# Altium project NUCLEOG431RB-Custom-IN-A2212.PrjPcb (part 2 of 3)

## Sheet Power_Section.SchDoc
size C
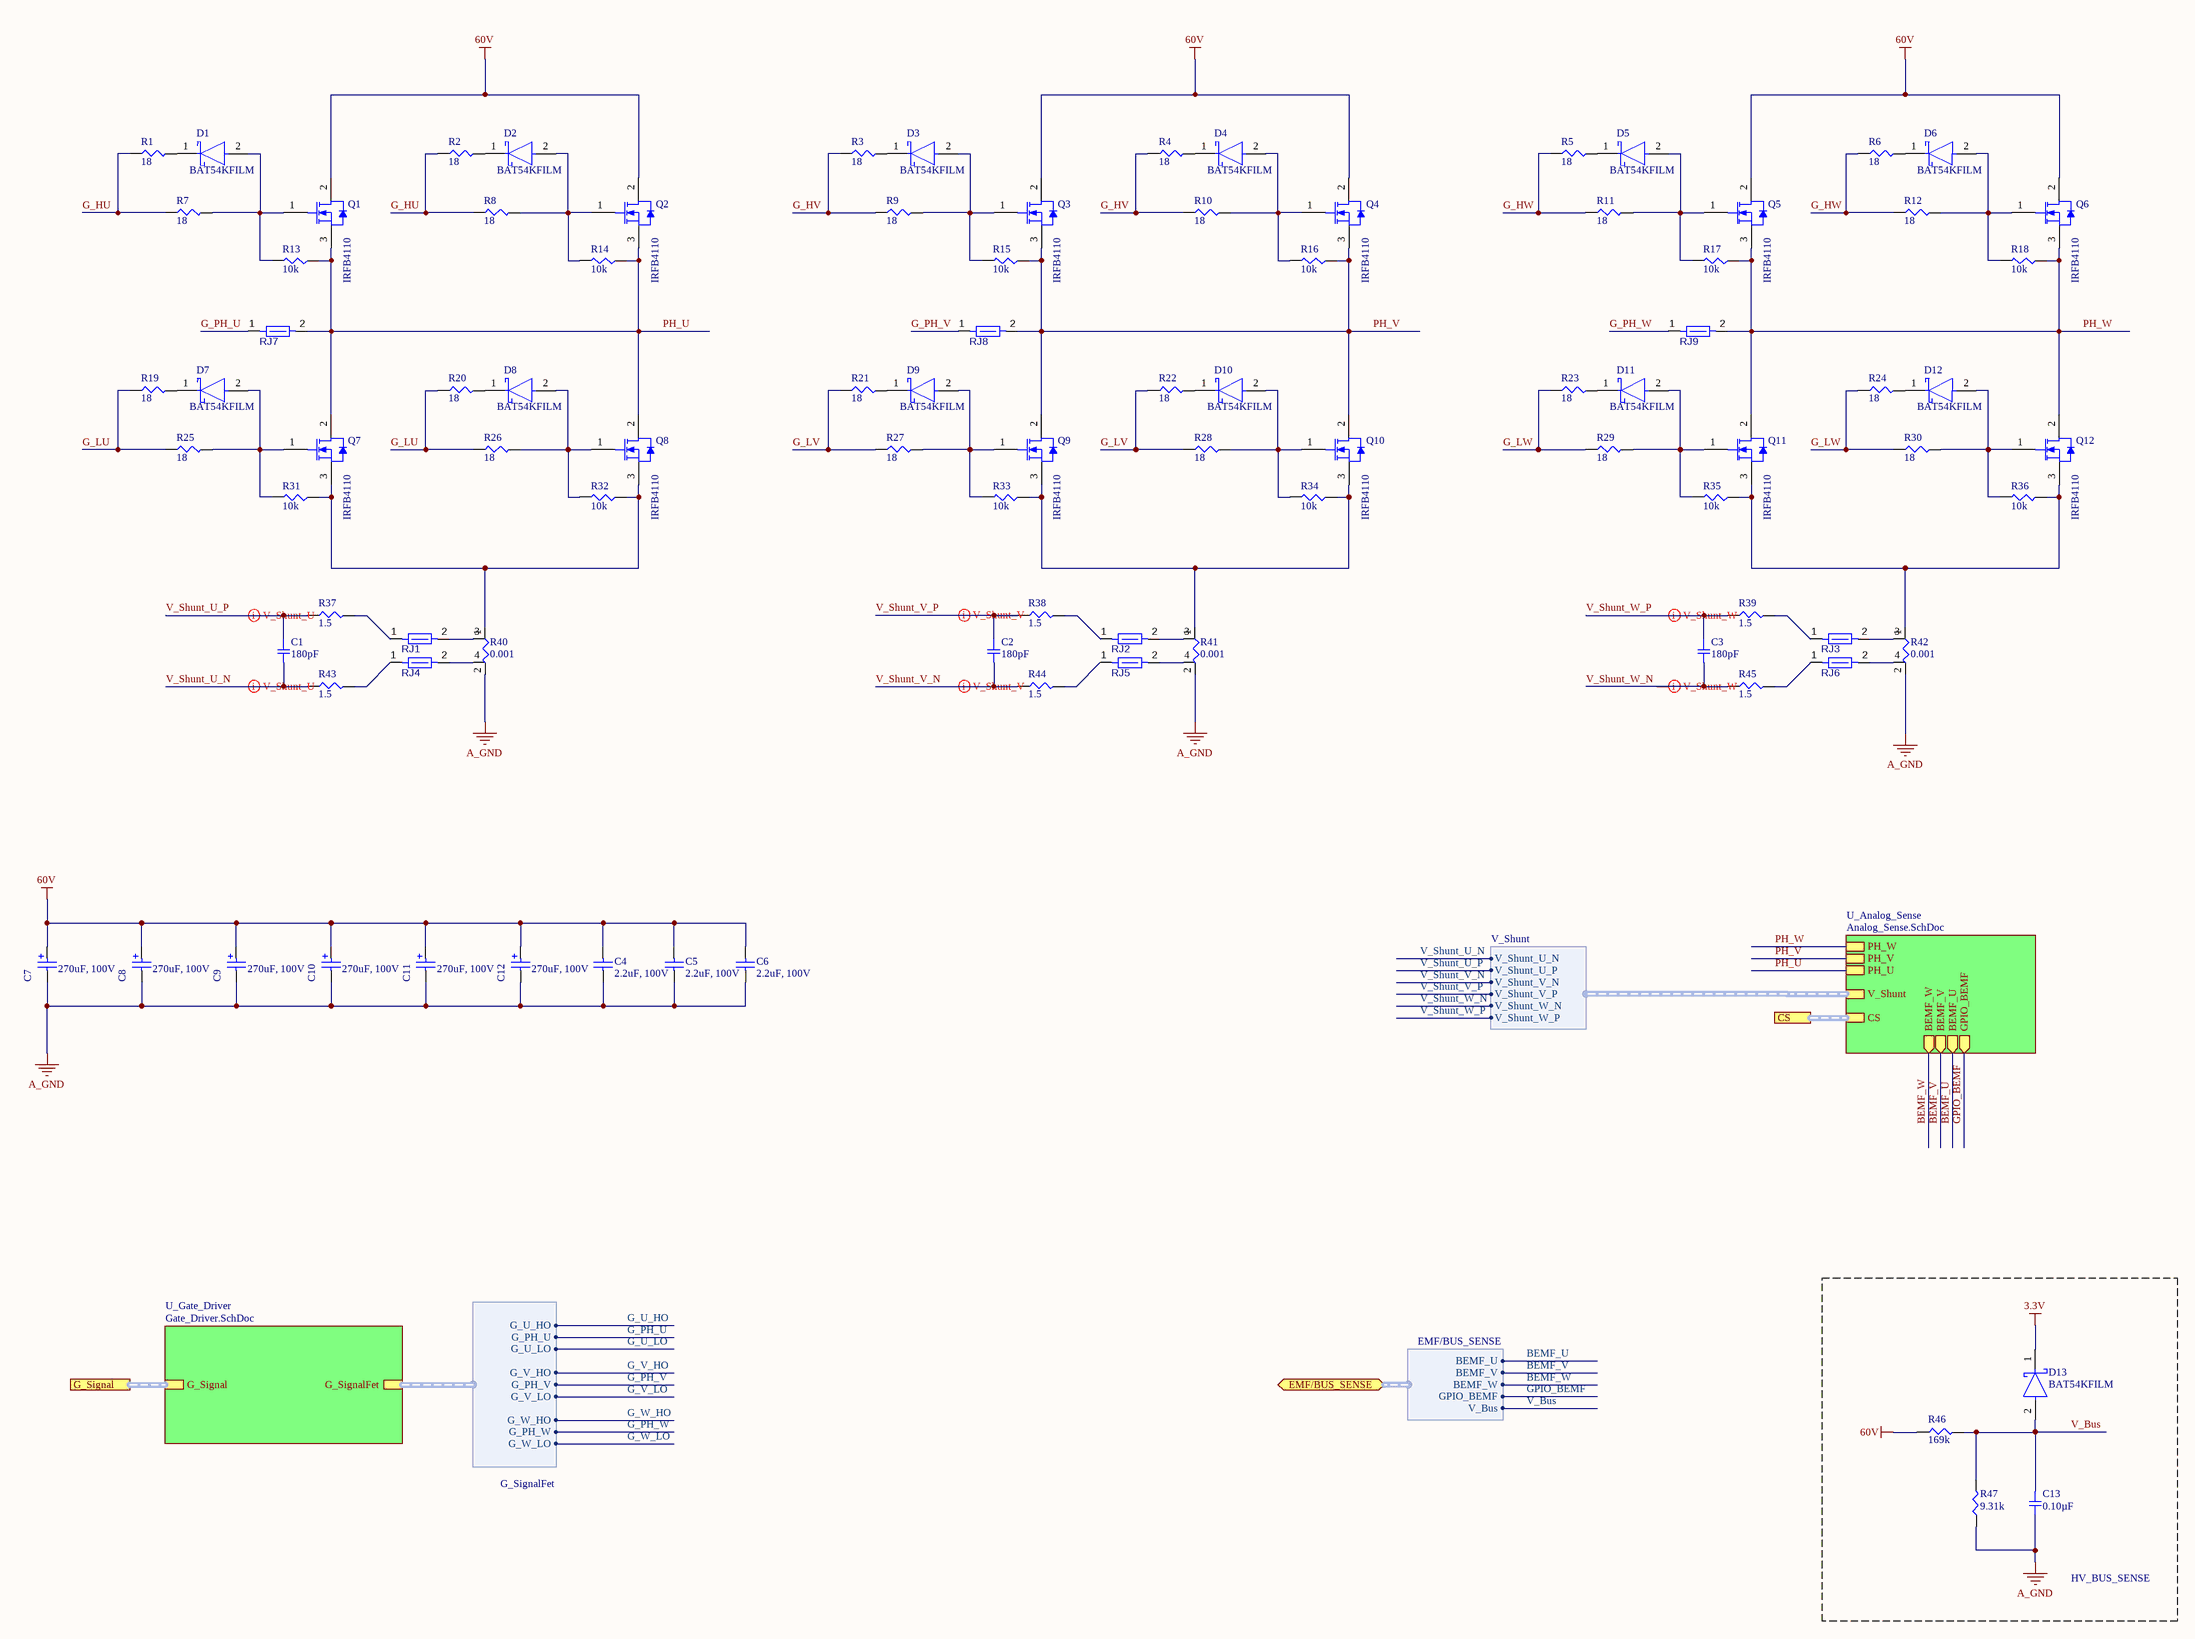
[diagram p3: Power_Section.SchDoc]

### Parts
C1  180pF  [SMD-0805C]
C2  180pF  [SMD-0805C]
C3  180pF  [SMD-0805C]
C4  2.2uF, 100V  [L18_W8.5_H15_P15]
C5  2.2uF, 100V  [L18_W8.5_H15_P15]
C6  2.2uF, 100V  [L18_W8.5_H15_P15]
C7  270uF, 100V  [WCAP-ATUL_16x25]
C8  270uF, 100V  [WCAP-ATUL_16x25]
C9  270uF, 100V  [WCAP-ATUL_16x25]
C10  270uF, 100V  [WCAP-ATUL_16x25]
C11  270uF, 100V  [WCAP-ATUL_16x25]
C12  270uF, 100V  [WCAP-ATUL_16x25]
C13  0.10µF  [SMD-0805C]
D1  BAT54KFILM  [FP-SOD-523-MFG]
D2  BAT54KFILM  [FP-SOD-523-MFG]
D3  BAT54KFILM  [FP-SOD-523-MFG]
D4  BAT54KFILM  [FP-SOD-523-MFG]
D5  BAT54KFILM  [FP-SOD-523-MFG]
D6  BAT54KFILM  [FP-SOD-523-MFG]
D7  BAT54KFILM  [FP-SOD-523-MFG]
D8  BAT54KFILM  [FP-SOD-523-MFG]
D9  BAT54KFILM  [FP-SOD-523-MFG]
D10  BAT54KFILM  [FP-SOD-523-MFG]
D11  BAT54KFILM  [FP-SOD-523-MFG]
D12  BAT54KFILM  [FP-SOD-523-MFG]
D13  BAT54KFILM  [FP-SOD-523-MFG]
Q1  IRFB4110  [TO-220-3_Horizontal_TabUp]
Q2  IRFB4110  [TO-220-3_Horizontal_TabUp]
Q3  IRFB4110  [TO-220-3_Horizontal_TabUp]
Q4  IRFB4110  [TO-220-3_Horizontal_TabUp]
Q5  IRFB4110  [TO-220-3_Horizontal_TabUp]
Q6  IRFB4110  [TO-220-3_Horizontal_TabUp]
Q7  IRFB4110  [TO-220-3_Horizontal_TabUp]
Q8  IRFB4110  [TO-220-3_Horizontal_TabUp]
Q9  IRFB4110  [TO-220-3_Horizontal_TabUp]
Q10  IRFB4110  [TO-220-3_Horizontal_TabUp]
Q11  IRFB4110  [TO-220-3_Horizontal_TabUp]
Q12  IRFB4110  [TO-220-3_Horizontal_TabUp]
R1  18  [SMD-0805-RES]
R2  18  [SMD-0805-RES]
R3  18  [SMD-0805-RES]
R4  18  [SMD-0805-RES]
R5  18  [SMD-0805-RES]
R6  18  [SMD-0805-RES]
R7  18  [SMD-0805-RES]
R8  18  [SMD-0805-RES]
R9  18  [SMD-0805-RES]
R10  18  [SMD-0805-RES]
R11  18  [SMD-0805-RES]
R12  18  [SMD-0805-RES]
R13  10k  [SMD-0805-RES]
R14  10k  [SMD-0805-RES]
R15  10k  [SMD-0805-RES]
R16  10k  [SMD-0805-RES]
R17  10k  [SMD-0805-RES]
R18  10k  [SMD-0805-RES]
R19  18  [SMD-0805-RES]
R20  18  [SMD-0805-RES]
R21  18  [SMD-0805-RES]
R22  18  [SMD-0805-RES]
R23  18  [SMD-0805-RES]
R24  18  [SMD-0805-RES]
R25  18  [SMD-0805-RES]
R26  18  [SMD-0805-RES]
R27  18  [SMD-0805-RES]
R28  18  [SMD-0805-RES]
R29  18  [SMD-0805-RES]
R30  18  [SMD-0805-RES]
R31  10k  [SMD-0805-RES]
R32  10k  [SMD-0805-RES]
R33  10k  [SMD-0805-RES]
R34  10k  [SMD-0805-RES]
R35  10k  [SMD-0805-RES]
R36  10k  [SMD-0805-RES]
R37  1.5  [SMD-0805-RES]
R38  1.5  [SMD-0805-RES]
R39  1.5  [SMD-0805-RES]
R40  0.001  [SMD-2512-RES]
R41  0.001  [SMD-2512-RES]
R42  0.001  [SMD-2512-RES]
R43  1.5  [SMD-0805-RES]
R44  1.5  [SMD-0805-RES]
R45  1.5  [SMD-0805-RES]
R46  169k  [SMD-0805-RES]
R47  9.31k  [SMD-0805-RES]
RJ1  Net Tie 12x8mil  [SHORT06-FP]  (value not drawn)  (net tie, no BOM)
RJ2  Net Tie 12x8mil  [SHORT06-FP]  (value not drawn)  (net tie, no BOM)
RJ3  Net Tie 12x8mil  [SHORT06-FP]  (value not drawn)  (net tie, no BOM)
RJ4  Net Tie 12x8mil  [SHORT06-FP]  (value not drawn)  (net tie, no BOM)
RJ5  Net Tie 12x8mil  [SHORT06-FP]  (value not drawn)  (net tie, no BOM)
RJ6  Net Tie 12x8mil  [SHORT06-FP]  (value not drawn)  (net tie, no BOM)
RJ7  Net Tie 12x8mil  [SHORT06-FP]  (value not drawn)  (net tie, no BOM)
RJ8  Net Tie 12x8mil  [SHORT06-FP]  (value not drawn)  (net tie, no BOM)
RJ9  Net Tie 12x8mil  [SHORT06-FP]  (value not drawn)  (net tie, no BOM)

### Blocks framed on the sheet
HV_BUS_SENSE: C13 D13 R46 R47

### Sub-sheets
U_Analog_Sense = Analog_Sense.SchDoc: PH_W, PH_U, PH_V, CS (harness CS), BEMF_W (out), BEMF_V (out), BEMF_U (out), GPIO_BEMF (out), V_Shunt (harness V_Shunt)
U_Gate_Driver = Gate_Driver.SchDoc: G_Signal (harness G_Signal), G_SignalFet (harness G_SignalFet)

### Ports
CS (harness CS), EMF/BUS_SENSE (bidir, harness EMF/BUS_SENSE), G_Signal (harness G_Signal)

### Harnesses
G_SignalFet: G_V_HO, G_PH_V, G_V_LO, G_PH_W, G_U_HO, G_PH_U, G_U_LO, G_W_HO, G_W_LO
EMF/BUS_SENSE: BEMF_U, BEMF_V, BEMF_W, GPIO_BEMF, V_Bus
V_Shunt: V_Shunt_U_N, V_Shunt_U_P, V_Shunt_V_N, V_Shunt_V_P, V_Shunt_W_N, V_Shunt_W_P

### Nets
3.3V: D13.1(C)
60V: C4.2 C5.2 C6.2 C7.2(P) C8.2(P) C9.2(P) C10.2(P) C11.2(P) C12.2(P) Q1.2(DRAIN) Q2.2(DRAIN) Q3.2(DRAIN) Q4.2(DRAIN) Q5.2(DRAIN) Q6.2(DRAIN) R46.1
A_GND: C4.1 C5.1 C6.1 C7.1(N) C8.1(N) C9.1(N) C10.1(N) C11.1(N) C12.1(N) C13.2 R40.2 R41.2 R42.2 R47.1
BEMF_U: sheet U_Analog_Sense/BEMF_U, port EMF/BUS_SENSE.BEMF_U
BEMF_V: sheet U_Analog_Sense/BEMF_V, port EMF/BUS_SENSE.BEMF_V
BEMF_W: sheet U_Analog_Sense/BEMF_W, port EMF/BUS_SENSE.BEMF_W
G_HU: R1.1 R2.1 R7.1 R8.1
G_HV: R3.1 R4.1 R9.1 R10.1
G_HW: R5.1 R6.1 R11.1 R12.1
G_LU: R19.1 R20.1 R25.1 R26.1
G_LV: R21.1 R22.1 R27.1 R28.1
G_LW: R23.1 R24.1 R29.1 R30.1
G_PH_U: RJ7.1 ; sheet U_Gate_Driver/G_SignalFet.G_PH_U
G_PH_V: RJ8.1 ; sheet U_Gate_Driver/G_SignalFet.G_PH_V
G_PH_W: RJ9.1 ; sheet U_Gate_Driver/G_SignalFet.G_PH_W
G_U_HO: sheet U_Gate_Driver/G_SignalFet.G_U_HO
G_U_LO: sheet U_Gate_Driver/G_SignalFet.G_U_LO
G_V_HO: sheet U_Gate_Driver/G_SignalFet.G_V_HO
G_V_LO: sheet U_Gate_Driver/G_SignalFet.G_V_LO
G_W_HO: sheet U_Gate_Driver/G_SignalFet.G_W_HO
G_W_LO: sheet U_Gate_Driver/G_SignalFet.G_W_LO
GPIO_BEMF: sheet U_Analog_Sense/GPIO_BEMF, port EMF/BUS_SENSE.GPIO_BEMF
PH_U: Q1.3(SOURCE) Q2.3(SOURCE) Q7.2(DRAIN) Q8.2(DRAIN) R13.1 R14.1 RJ7.2 ; sheet U_Analog_Sense/PH_U
PH_V: Q3.3(SOURCE) Q4.3(SOURCE) Q9.2(DRAIN) Q10.2(DRAIN) R15.1 R16.1 RJ8.2 ; sheet U_Analog_Sense/PH_V
PH_W: Q5.3(SOURCE) Q6.3(SOURCE) Q11.2(DRAIN) Q12.2(DRAIN) R17.1 R18.1 RJ9.2 ; sheet U_Analog_Sense/PH_W
V_Bus: C13.1 D13.2(A) R46.2 R47.2 ; port EMF/BUS_SENSE.V_Bus
V_Shunt_U_N: C1.2 R43.1 ; sheet U_Analog_Sense/V_Shunt.V_Shunt_U_N
V_Shunt_U_P: C1.1 R37.1 ; sheet U_Analog_Sense/V_Shunt.V_Shunt_U_P
V_Shunt_V_N: C2.2 R44.1 ; sheet U_Analog_Sense/V_Shunt.V_Shunt_V_N
V_Shunt_V_P: C2.1 R38.1 ; sheet U_Analog_Sense/V_Shunt.V_Shunt_V_P
V_Shunt_W_N: C3.2 R45.1 ; sheet U_Analog_Sense/V_Shunt.V_Shunt_W_N
V_Shunt_W_P: C3.1 R39.1 ; sheet U_Analog_Sense/V_Shunt.V_Shunt_W_P
NetD1_1: D1.1(C) R1.2
NetD1_2: D1.2(A) Q1.1(GATE) R7.2 R13.2
NetD2_1: D2.1(C) R2.2
NetD2_2: D2.2(A) Q2.1(GATE) R8.2 R14.2
NetD3_1: D3.1(C) R3.2
NetD3_2: D3.2(A) Q3.1(GATE) R9.2 R15.2
NetD4_1: D4.1(C) R4.2
NetD4_2: D4.2(A) Q4.1(GATE) R10.2 R16.2
NetD5_1: D5.1(C) R5.2
NetD5_2: D5.2(A) Q5.1(GATE) R11.2 R17.2
NetD6_1: D6.1(C) R6.2
NetD6_2: D6.2(A) Q6.1(GATE) R12.2 R18.2
NetD7_1: D7.1(C) R19.2
NetD7_2: D7.2(A) Q7.1(GATE) R25.2 R31.2
NetD8_1: D8.1(C) R20.2
NetD8_2: D8.2(A) Q8.1(GATE) R26.2 R32.2
NetD9_1: D9.1(C) R21.2
NetD9_2: D9.2(A) Q9.1(GATE) R27.2 R33.2
NetD10_1: D10.1(C) R22.2
NetD10_2: D10.2(A) Q10.1(GATE) R28.2 R34.2
NetD11_1: D11.1(C) R23.2
NetD11_2: D11.2(A) Q11.1(GATE) R29.2 R35.2
NetD12_1: D12.1(C) R24.2
NetD12_2: D12.2(A) Q12.1(GATE) R30.2 R36.2
NetQ7_3: Q7.3(SOURCE) Q8.3(SOURCE) R31.1 R32.1 R40.1
NetQ9_3: Q9.3(SOURCE) Q10.3(SOURCE) R33.1 R34.1 R41.1
NetQ11_3: Q11.3(SOURCE) Q12.3(SOURCE) R35.1 R36.1 R42.1
NetR37_2: R37.2 RJ1.1
NetR38_2: R38.2 RJ2.1
NetR39_2: R39.2 RJ3.1
NetR40_3: R40.3 RJ1.2
NetR40_4: R40.4 RJ4.2
NetR41_3: R41.3 RJ2.2
NetR41_4: R41.4 RJ5.2
NetR42_3: R42.3 RJ3.2
NetR42_4: R42.4 RJ6.2
NetR43_2: R43.2 RJ4.1
NetR44_2: R44.2 RJ5.1
NetR45_2: R45.2 RJ6.1

### Buses and harness runs
harness port CS = sheet U_Analog_Sense/CS
harness port G_Signal = sheet U_Gate_Driver/G_Signal

### Layout directives
differential pair: V_Shunt_U_N, V_Shunt_U_P, V_Shunt_V_N, V_Shunt_V_P, V_Shunt_W_N, V_Shunt_W_P

### Library data of the parts
C1-C3 = GQM2195C2A181GB12D: CAP CER 180PF 100V NP0 0805; Manufacturer: Murata Electronics North America; Factory Stock: 0; Unit Price (USD): 1.44; Minimum Quantity: 1; Tolerance: ±2%; Temperature Coefficient: C0G, NP0; Datasheets: http://www.murata.com/~/media/webrenewal/support/library/catalog/products/capacitor/mlcc/c02e.pdf; Image: //media.digikey.com/Renders/Murata%20Renders/0805(GxM9).jpg; Digi-Key Part Number: 490-7180-1-ND; Part Number: GQM2195C2A181GB12D; Quantity Available: 7523; @ qty: 0; Packaging: Cut Tape (CT); Series: GQM; Part Status: Active; Value: 180pF; Voltage: 100V; Operating Temperature: -55°C ~ 125°C; Features: High Q, Low Loss; Ratings: -; Applications: RF, Microwave, High Frequency; Mounting Type: Surface Mount, MLCC; Package / Case: 0805 (2012 Metric); Size / Dimension: 0.079" L x 0.049" W (2.01mm x 1.25mm); Height - Seated (Max): -; Thickness (Max): 0.037" (0.95mm); Lead Spacing: -; Lead Style: -
C4-C6 = 890263425004CS: WCAP-FTBE THT Film Capacitors, 2.2uF, 100VDC; Insulation Resistance: 3000Ohm x F; Dissipation Factor@100kHz: 5%; Dissipation Factor@1kHz: 1%; Dissipation Factor@10kHz: 1.6%; Pitch: 15mm; Rate of Voltage Rise: 9V/us; Technical Reference: MPSP015225K100DCPP45004; ComponentLink1Description: Manufacturer; ComponentLink1URL: http://www.we-online.de; ComponentLink2Description: Datasheet; ComponentLink2URL: https://katalog.we-online.com/pbs/datasheet/890263425004CS.pdf; Length: 18mm; Mounting Technology: THT; Packaging: Carton; Part Number: 890263425004CS; Operating Temperature: -40 to +85degC; Width: 8.5mm; Capacitance: 2.2uF; Height: 15mm; Rated Voltage: 100VDC; Publisher: Wurth Elektronik; Published Date: August 2019
C7-C12 = 860040880007: WCAP-ATUL THT Aluminum Electrolytic Capacitors, D16mm x L25mm, 270uF, +/-20%, 100VDC; Dissipation Factor: 9%; Endurance: 10000h; Leakage Current: 270uA; Ripple Current max.: 1480mA; Technical Reference: ATDK250271M100DSPAEK000; ComponentLink1Description: Manufacturer; ComponentLink1URL: http://www.we-online.de; ComponentLink2Description: Datasheet; ComponentLink2URL: https://katalog.we-online.com/pbs/datasheet/860040880007.pdf; Length: 25mm; Mounting Technology: THT; Operating Temperature: -40 to +105degC; Packaging: Ammo Pack; Published Date: August 2019; Capacitance: 270uF; Diameter: 16mm; Part Number: 860040880007; Publisher: Wurth Elektronik; Capacitance Tolerance: +/-20%; Rated Voltage: 100VDC
C13 = GCD21BR71H104KA01L: CAP CER 0.1UF 50V X7R 0805; Manufacturer: Murata Electronics North America; Factory Stock: 0; Unit Price (USD): 0.24; Minimum Quantity: 1; Tolerance: ±10%; Datasheets: http://www.murata.com/~/media/webrenewal/support/library/catalog/products/capacitor/mlcc/c03e.ashx; Image: //media.digikey.com/Renders/Murata%20Renders/0805%28GxM6%29.jpg; Digi-Key Part Number: 490-11955-1-ND; Part Number: GCD21BR71H104KA01L; Quantity Available: 157; @ qty: 0; Packaging: Cut Tape (CT); Series: GCD; Part Status: Active; Value: 0.10µF; Voltage: 50V; Temperature Coefficient: X7R; Operating Temperature: -55°C ~ 125°C; Features: -; Ratings: AEC-Q200; Applications: Automotive; Mounting Type: Surface Mount, MLCC; Package / Case: 0805 (2012 Metric); Size / Dimension: 0.079" L x 0.049" W (2.00mm x 1.25mm); Height - Seated (Max): -; Thickness (Max): 0.049" (1.25mm); Lead Spacing: -; Lead Style: -
D1-D13 = CMP-12187-000026-1: DIODE SCHOTTKY 40V 300MA SOD523; Manufacturer: STMicroelectronics; Capacitance: 7pF; Value: 7pF; Max Surge Forward Current: 1.25A; Peak Reverse Current: 1uA; Max Junction Temp: +150°C; Device Class L2: Diodes; Temperature Range Low: -40°C; Category: Diode; Manufacturer Part Number: BAT54KFILM; Digikey Description: DIODE SCHOTTKY 40V 300MA SOD523; Device Class L3: Schottky Diodes; Automotive: No; Height: 0.7mm; Octopart: https://octopart.com/bat54kfilm-stmicroelectronics-39618022; ComponentLink2Description: Datasheet; Temperature Range High: +150°C; Device Class L1: Discrete Semiconductors; Max Repetitive Reverse Voltage: 40V; RoHS: TRUE; Temperature: -40°C to +150°C; ComponentLink2URL: https://www.st.com/content/ccc/resource/technical/document/datasheet/07/50/54/f2/0d/ba/4a/79/CD00001322.pdf/files/CD00001322.pdf/jcr:content/translations/en.CD00001322.pdf; Lead Free: Yes; Forward Current: 300mA; Package: SOD-523; Mouser Description: Schottky Diodes & Rectifiers schottky diode
Q1-Q12 = CUSTOM-MOS: 100V 120A; PartNumber: IPW65R110CFDA; Manufacturer: Infineon; QG: 118Â nC; Green: TRUE; Ptot (max): 277.8Â W; VGS(th) (max): 4.5Â V; VDS (max): 650Â V; RthJA (max): 62Â K/W; IDpuls (max): 99.6Â A; RDS (on) (max): 110Â mOhm; VGS(th) (min): 3.5Â V; Rth: 0.45Â K/W; Packing: Tube; ID (max): 31.2Â A; Polarity: N; ComponentLink1Description: Manufacturer URL; ComponentLink3Description: Package Specification; DatasheetVersion: Rev. 2.0; PackageDescription: 3-Pin Plastic (Green) Transistor Single Outline Package, 15.94 x 20.95 mm Body, 5.44 mm Pitch; Halogen-free: available; Mounting Technology: Through Hole; PackageVersion: Rev. 03; ComponentLink2Description: Datasheet; ComponentLink3URL: http://www.infineon.com/cms/packages/Leaded_and_through-hole/P-PG-TO247/P-PG-TO247-3-44.html?__locale=en; ComponentLink2URL: http://www.infineon.com/dgdl/DS_IPX65R110CFDA_2_0.pdf?folderId=db3a3043163797a6011637d4bae7003b&fileId=db3a304336797ff90136ba7c820925a5; Technology: CoolMOS CFDA; PackageReference: PG-TO247-3-44; ComponentLink1URL: http://www.infineon.com/; RthJC (max): 0.45Â K/W
R1-R12 R19-R30 = ERJ-P06J180V: RES SMD 18 OHM 5% 1/2W 0805; Manufacturer: Panasonic Electronic Components; Factory Stock: 0; Unit Price (USD): 0.01839; @ qty: 1500; Minimum Quantity: 1; Power (Watts): 0.5W, 1/2W; Temperature Coefficient: ±300ppm/°C; Part Number: ERJ-P06J180V; Datasheets: https://industrial.panasonic.com/cdbs/www-data/pdf/RDA0000/AOA0000C243.pdf; Image: //media.digikey.com/Renders/Panasonic%20Renders/ERJ-0805%20Pkg.jpg; Digi-Key Part Number: P18ADCT-ND; Quantity Available: 114565; Packaging: Cut Tape (CT); Series: ERJ; Part Status: Active; Value: 18; Tolerance: ±5%; Composition: Thick Film; Features: Automotive AEC-Q200, Pulse Withstanding; Operating Temperature: -55°C ~ 155°C; Package / Case: 0805 (2012 Metric); Supplier Device Package: 0805; Size / Dimension: 0.079" L x 0.049" W (2.00mm x 1.25mm); Height - Seated (Max): 0.028" (0.70mm); Number of Terminations: 2; Failure Rate: -
R13-R18 R31-R36 = ERJ-6ENF1002V: RES SMD 10K OHM 1% 1/8W 0805; Manufacturer: Panasonic Electronic Components; Factory Stock: 0; Unit Price (USD): 0.00729; @ qty: 1500; Minimum Quantity: 1; Power (Watts): 0.125W, 1/8W; Temperature Coefficient: ±100ppm/°C; Part Number: ERJ-6ENF1002V; Datasheets: http://industrial.panasonic.com/www-cgi/jvcr13pz.cgi?E+PZ+3+AOA0002+ERJ6ENF1002V+7+WW; Image: //media.digikey.com/Renders/Panasonic%20Renders/ERJ-0805%20Pkg.jpg; Digi-Key Part Number: P10.0KCCT-ND; Quantity Available: 3985614; Packaging: Cut Tape (CT); Series: ERJ; Part Status: Active; Value: 10k; Tolerance: ±1%; Composition: Thick Film; Features: Automotive AEC-Q200; Operating Temperature: -55°C ~ 155°C; Package / Case: 0805 (2012 Metric); Supplier Device Package: 0805; Size / Dimension: 0.079" L x 0.049" W (2.00mm x 1.25mm); Height - Seated (Max): 0.028" (0.70mm); Number of Terminations: 2; Failure Rate: -
R37-R39 R43-R45 = ERJ-6BQF1R5V: RES SMD 1.5 OHM 1% 1/3W 0805; Manufacturer: Panasonic Electronic Components; Factory Stock: 0; Unit Price (USD): 0.07013; @ qty: 1500; Minimum Quantity: 1; Power (Watts): 0.333W, 1/3W; Temperature Coefficient: ±200ppm/°C; Part Number: ERJ-6BQF1R5V; Datasheets: https://industrial.panasonic.com/cdbs/www-data/pdf/RDA0000/AOA0000C239.pdf; Image: //media.digikey.com/Renders/Panasonic%20Renders/ERJ-0805%20Pkg.jpg; Digi-Key Part Number: P15992CT-ND; Quantity Available: 5905; Packaging: Cut Tape (CT); Series: ERJ; Part Status: Active; Value: 1.5; Tolerance: ±1%; Composition: Thick Film; Features: Automotive AEC-Q200, Current Sense; Operating Temperature: -55°C ~ 125°C; Package / Case: 0805 (2012 Metric); Supplier Device Package: 0805; Size / Dimension: 0.079" L x 0.049" W (2.00mm x 1.25mm); Height - Seated (Max): 0.028" (0.70mm); Number of Terminations: 2; Failure Rate: -
R40-R42 = ERJ-M1WTF1M0U: RES SMD 0.001 OHM 1% 1W 2512; Manufacturer: Panasonic Electronic Components; Factory Stock: 0; Unit Price (USD): 0.26384; @ qty: 1500; Minimum Quantity: 1; Temperature Coefficient: 250/ +450ppm/°C; Part Number: ERJ-M1WTF1M0U; Datasheets: http://industrial.panasonic.com/www-cgi/jvcr13pz.cgi?E+PZ+3+AOA0007+ERJM1WTF1M0U+7+WW; Image: //media.digikey.com/Renders/Panasonic%20Renders/ERJ-2512%20Pkg.jpg; Digi-Key Part Number: P1.0NDCT-ND; Quantity Available: 22959; Packaging: Cut Tape (CT); Series: ERJ; Part Status: Active; Value: 0.001; Tolerance: ±1%; Power (Watts): 1W; Composition: Metal Element; Features: Current Sense; Operating Temperature: -55°C ~ 170°C; Package / Case: 2512 (6432 Metric); Supplier Device Package: 2512; Size / Dimension: 0.252" L x 0.126" W (6.40mm x 3.20mm); Height - Seated (Max): 0.043" (1.10mm); Number of Terminations: 2; Failure Rate: -
R46 = ERJ-6ENF1693V: RES SMD 169K OHM 1% 1/8W 0805; Manufacturer: Panasonic Electronic Components; Factory Stock: 0; Unit Price (USD): 0.00729; @ qty: 1500; Minimum Quantity: 1; Power (Watts): 0.125W, 1/8W; Temperature Coefficient: ±100ppm/°C; Part Number: ERJ-6ENF1693V; Datasheets: http://industrial.panasonic.com/www-cgi/jvcr13pz.cgi?E+PZ+3+AOA0002+ERJ6ENF1693V+7+WW; Image: //media.digikey.com/Renders/Panasonic%20Renders/ERJ-0805%20Pkg.jpg; Digi-Key Part Number: P169KCCT-ND; Quantity Available: 4864; Packaging: Cut Tape (CT); Series: ERJ; Part Status: Active; Value: 169k; Tolerance: ±1%; Composition: Thick Film; Features: Automotive AEC-Q200; Operating Temperature: -55°C ~ 155°C; Package / Case: 0805 (2012 Metric); Supplier Device Package: 0805; Size / Dimension: 0.079" L x 0.049" W (2.00mm x 1.25mm); Height - Seated (Max): 0.028" (0.70mm); Number of Terminations: 2; Failure Rate: -
R47 = ERJ-6ENF9311V: RES SMD 9.31K OHM 1% 1/8W 0805; Manufacturer: Panasonic Electronic Components; Factory Stock: 0; Unit Price (USD): 0.00729; @ qty: 1500; Minimum Quantity: 1; Power (Watts): 0.125W, 1/8W; Temperature Coefficient: ±100ppm/°C; Part Number: ERJ-6ENF9311V; Datasheets: http://industrial.panasonic.com/www-cgi/jvcr13pz.cgi?E+PZ+3+AOA0002+ERJ6ENF9311V+7+WW; Image: //media.digikey.com/Renders/Panasonic%20Renders/ERJ-0805%20Pkg.jpg; Digi-Key Part Number: P9.31KCCT-ND; Quantity Available: 47337; Packaging: Cut Tape (CT); Series: ERJ; Part Status: Active; Value: 9.31k; Tolerance: ±1%; Composition: Thick Film; Features: Automotive AEC-Q200; Operating Temperature: -55°C ~ 155°C; Package / Case: 0805 (2012 Metric); Supplier Device Package: 0805; Size / Dimension: 0.079" L x 0.049" W (2.00mm x 1.25mm); Height - Seated (Max): 0.028" (0.70mm); Number of Terminations: 2; Failure Rate: -
RJ1-RJ9 = CMP-009-00121-1: Max Operating Temperature: 155°C; Min Operating Temperature: -55°C; Pins: 2

## Sheet Gate_Driver.SchDoc
size A3
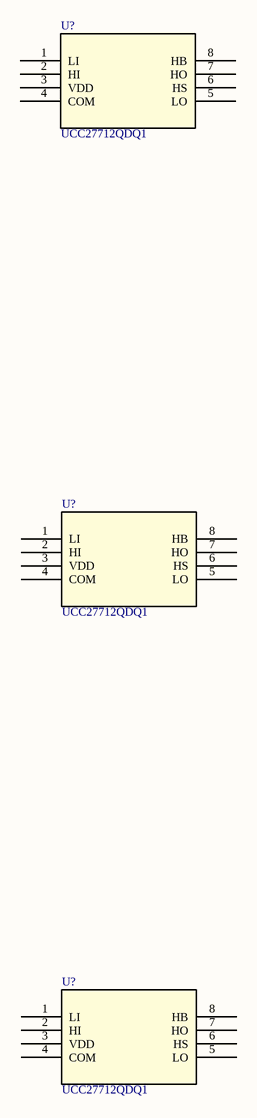
[diagram p4: Gate_Driver.SchDoc]

### Parts
(Parts that share a designator on the sheet are numbered #1, #2 ... from top to bottom, then left to right.)
U?#1  UCC27712QDQ1  [SOIC127P570X175_HS-9N]
U?#2  UCC27712QDQ1  [SOIC127P570X175_HS-9N]
U?#3  UCC27712QDQ1  [SOIC127P570X175_HS-9N]

### Nets

Not connected (* = marked no-connect by the designer): U?#1 1(LI) 2(HI) 3(VDD) 4(COM) 5(LO) 6(HS) 7(HO) 8(HB); U?#2 1(LI) 2(HI) 3(VDD) 4(COM) 5(LO) 6(HS) 7(HO) 8(HB); U?#3 1(LI) 2(HI) 3(VDD) 4(COM) 5(LO) 6(HS) 7(HO) 8(HB)

### Library data of the parts
U?#1-U?#3 = UCC27712QDQ1: No Description Available; Vendor: Texas Instruments; Built_By: EMA_Molly; SourceLibrary: TI_2019-05-11; Manufacturer_Part_Number: UCC27712QDQ1; Copyright: Copyright (C) 2018 Accelerated Designs. All rights reserved; RefDes: RefDes; Type: DEV

## Sheet Analog_Sense.SchDoc
size A3
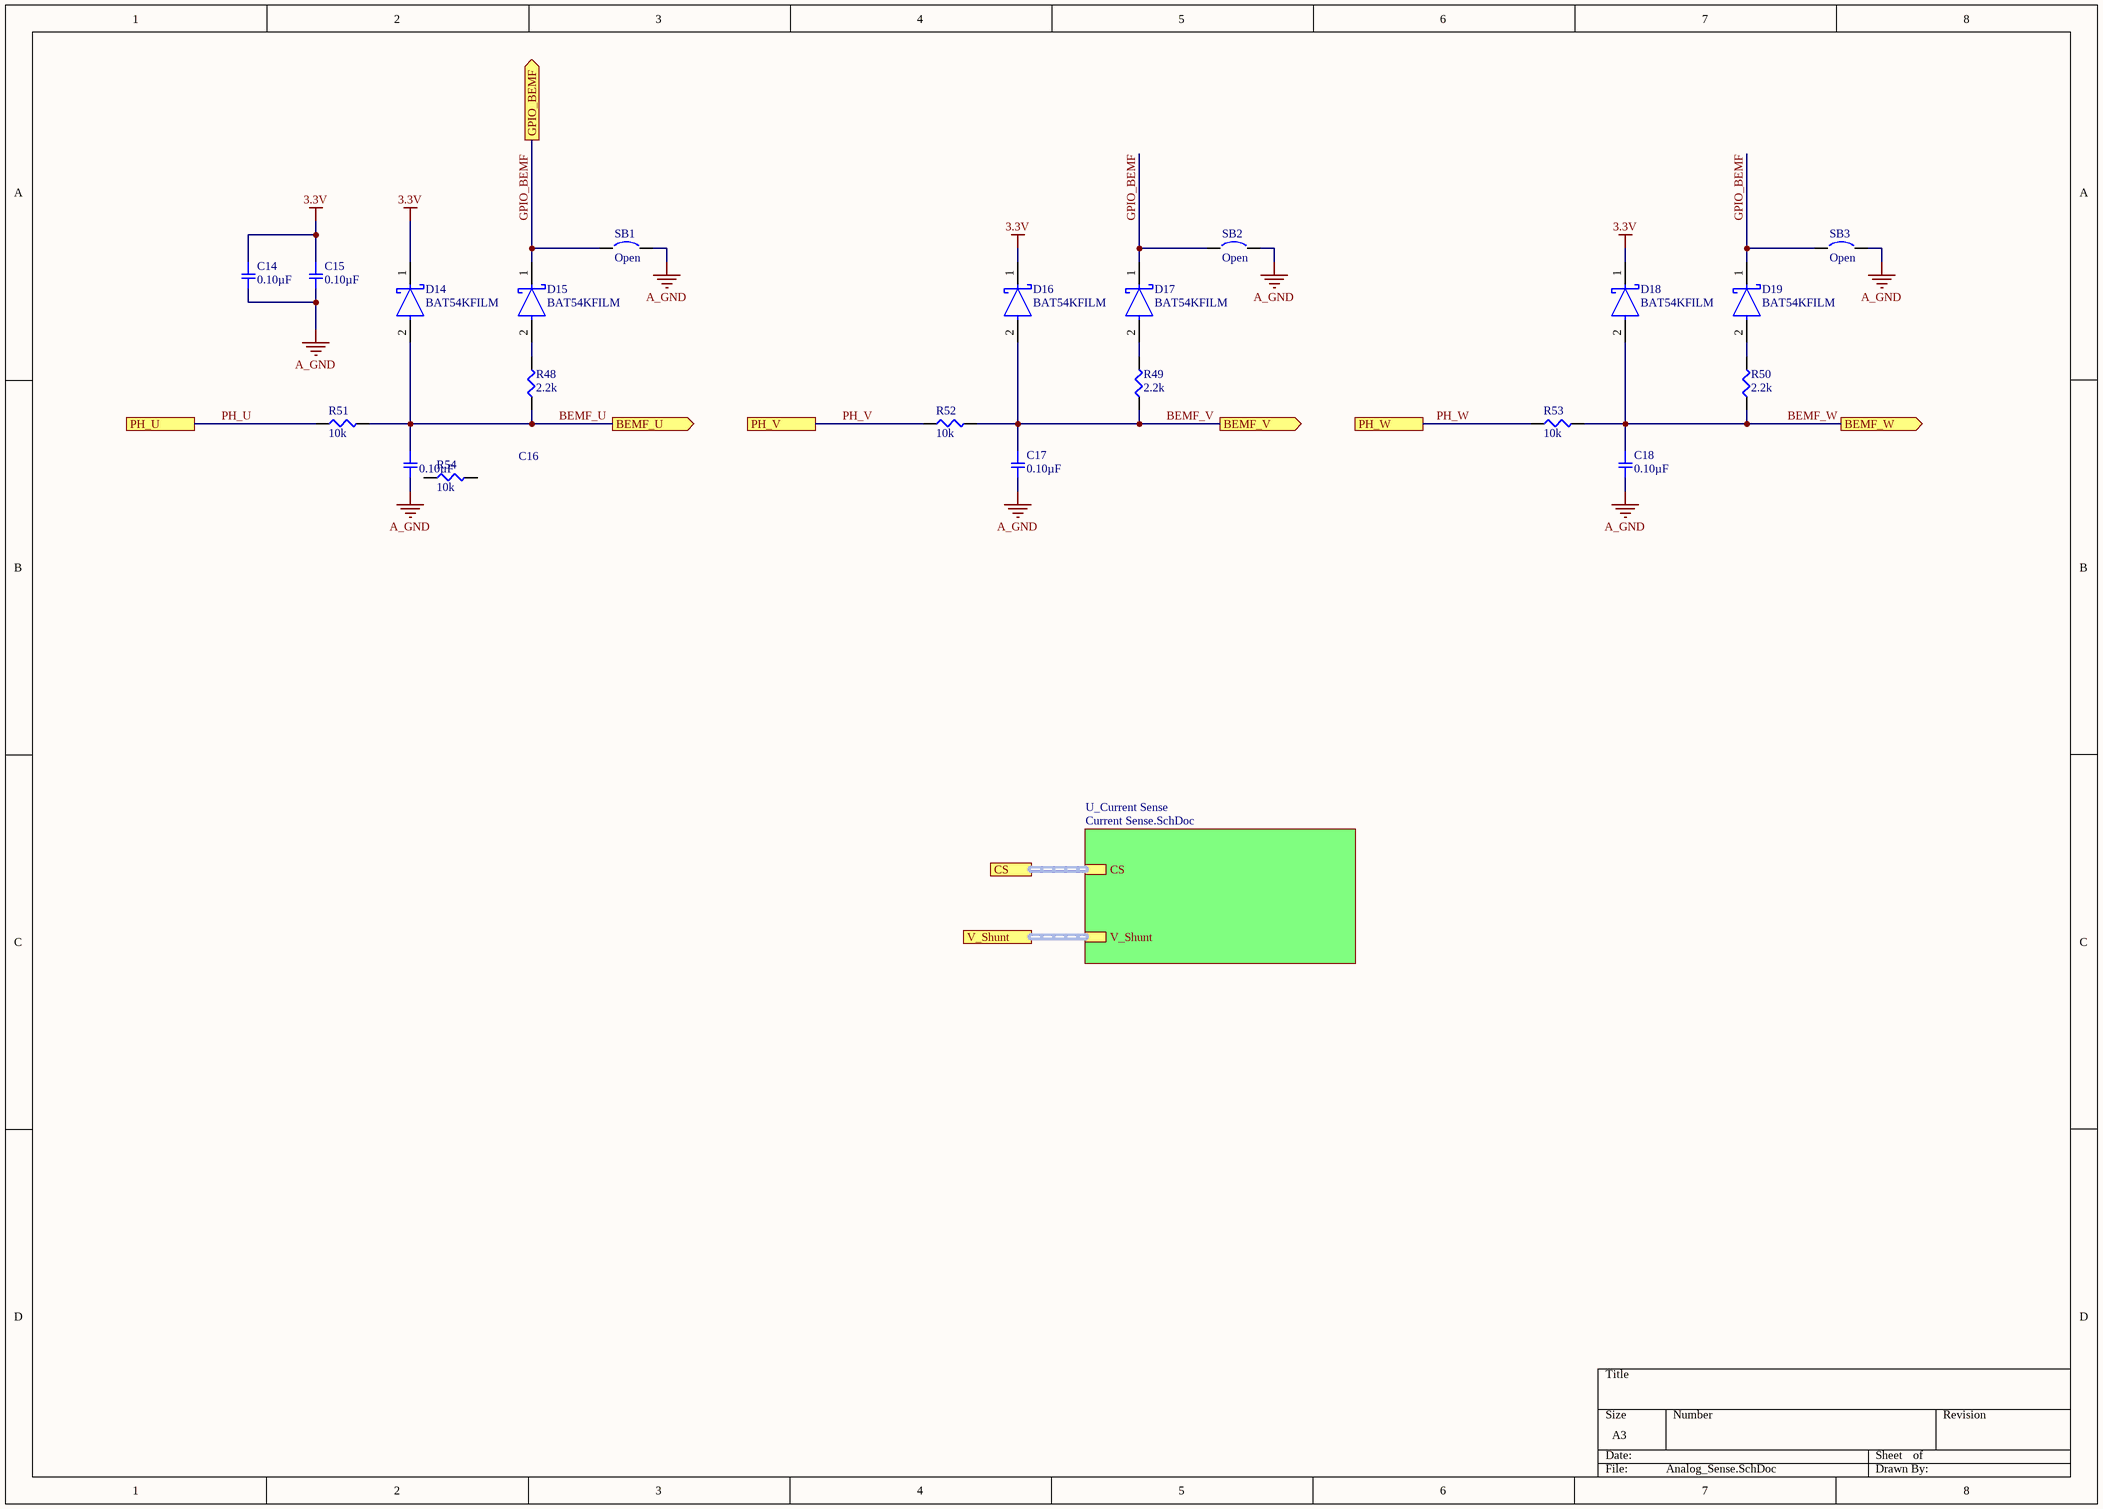
[diagram p5: Analog_Sense.SchDoc]

### Parts
C14  0.10µF  [SMD-0805C]
C15  0.10µF  [SMD-0805C]
C16  0.10µF  [SMD-0805C]
C17  0.10µF  [SMD-0805C]
C18  0.10µF  [SMD-0805C]
D14  BAT54KFILM  [FP-SOD-523-MFG]
D15  BAT54KFILM  [FP-SOD-523-MFG]
D16  BAT54KFILM  [FP-SOD-523-MFG]
D17  BAT54KFILM  [FP-SOD-523-MFG]
D18  BAT54KFILM  [FP-SOD-523-MFG]
D19  BAT54KFILM  [FP-SOD-523-MFG]
R48  2.2k  [SMD-1206-RES]
R49  2.2k  [SMD-1206-RES]
R50  2.2k  [SMD-1206-RES]
R51  10k  [SMD-0805-RES]
R52  10k  [SMD-0805-RES]
R53  10k  [SMD-0805-RES]
R54  10k  [SMD-0805-RES]
SB1  Open  [SB_0603]  (no BOM)
SB2  Open  [SB_0603]  (no BOM)
SB3  Open  [SB_0603]  (no BOM)

### Sub-sheets
U_Current Sense = Current Sense.SchDoc: CS (harness CS), V_Shunt (harness V_Shunt)

### Ports
BEMF_U (out), BEMF_V (out), BEMF_W (out), CS (harness CS), GPIO_BEMF (out), PH_U, PH_V, PH_W, V_Shunt (harness V_Shunt)

### Nets
3.3V: C14.1 C15.1 D14.1(C) D16.1(C) D18.1(C)
A_GND: C14.2 C15.2 C16.2 C17.2 C18.2 SB1.2 SB2.2 SB3.2
BEMF_U: C16.1 D14.2(A) R48.1 R51.2 ; port BEMF_U
BEMF_V: C17.1 D16.2(A) R49.1 R52.2 ; port BEMF_V
BEMF_W: C18.1 D18.2(A) R50.1 R53.2 ; port BEMF_W
GPIO_BEMF: D15.1(C) D17.1(C) D19.1(C) SB1.1 SB2.1 SB3.1 ; port GPIO_BEMF
PH_U: R51.1 ; port PH_U
PH_V: R52.1 ; port PH_V
PH_W: R53.1 ; port PH_W
NetD15_2: D15.2(A) R48.2
NetD17_2: D17.2(A) R49.2
NetD19_2: D19.2(A) R50.2

Not connected (* = marked no-connect by the designer): R54 1 2

### Buses and harness runs
harness port CS = sheet U_Current Sense/CS
harness port V_Shunt = sheet U_Current Sense/V_Shunt

### Library data of the parts
C14-C18 = GCD21BR71H104KA01L: as C13 on sheet Power_Section; Datasheets: http://www.murata.com/~/media/webrenewal/support/library/catalog/products/capacitor/mlcc/c03e.ashx; Image: //media.digikey.com/Renders/Murata%20Renders/0805%28GxM6%29.jpg; Digi-Key Part Number: 490-11955-1-ND; Part Number: GCD21BR71H104KA01L; Quantity Available: 157; @ qty: 0; Packaging: Cut Tape (CT); Series: GCD; Part Status: Active; Value: 0.10µF; Voltage: 50V; Temperature Coefficient: X7R; Operating Temperature: -55°C ~ 125°C; Features: -; Ratings: AEC-Q200; Applications: Automotive; Mounting Type: Surface Mount, MLCC; Package / Case: 0805 (2012 Metric); Size / Dimension: 0.079" L x 0.049" W (2.00mm x 1.25mm); Height - Seated (Max): -; Thickness (Max): 0.049" (1.25mm); Lead Spacing: -; Lead Style: -
D14-D19 = CMP-12187-000026-1: as D1 on sheet Power_Section; Device Class L2: Diodes; Temperature Range Low: -40°C; Category: Diode; Manufacturer Part Number: BAT54KFILM; Digikey Description: DIODE SCHOTTKY 40V 300MA SOD523; Device Class L3: Schottky Diodes; Automotive: No; Height: 0.7mm; Octopart: https://octopart.com/bat54kfilm-stmicroelectronics-39618022; ComponentLink2Description: Datasheet; Temperature Range High: +150°C; Device Class L1: Discrete Semiconductors; Max Repetitive Reverse Voltage: 40V; RoHS: TRUE; Temperature: -40°C to +150°C; ComponentLink2URL: https://www.st.com/content/ccc/resource/technical/document/datasheet/07/50/54/f2/0d/ba/4a/79/CD00001322.pdf/files/CD00001322.pdf/jcr:content/translations/en.CD00001322.pdf; Lead Free: Yes; Forward Current: 300mA; Package: SOD-523; Mouser Description: Schottky Diodes & Rectifiers schottky diode
R48-R50 = ERJ-8ENF2201V: RES SMD 2.2K OHM 1% 1/4W 1206; Manufacturer: Panasonic Electronic Components; Factory Stock: 0; Unit Price (USD): 0.00933; @ qty: 1500; Minimum Quantity: 1; Power (Watts): 0.25W, 1/4W; Temperature Coefficient: ±100ppm/°C; Part Number: ERJ-8ENF2201V; Datasheets: http://industrial.panasonic.com/www-cgi/jvcr13pz.cgi?E+PZ+3+AOA0002+ERJ8ENF2201V+7+WW; Image: //media.digikey.com/Renders/Panasonic%20Renders/ERJ-1206%20Pkg.jpg; Digi-Key Part Number: P2.20KFCT-ND; Quantity Available: 220817; Packaging: Cut Tape (CT); Series: ERJ; Part Status: Active; Value: 2.2k; Tolerance: ±1%; Composition: Thick Film; Features: Automotive AEC-Q200; Operating Temperature: -55°C ~ 155°C; Package / Case: 1206 (3216 Metric); Supplier Device Package: 1206; Size / Dimension: 0.126" L x 0.063" W (3.20mm x 1.60mm); Height - Seated (Max): 0.028" (0.70mm); Number of Terminations: 2; Failure Rate: -
R51-R54 = ERJ-6ENF1002V: as R13 on sheet Power_Section; Part Number: ERJ-6ENF1002V; Datasheets: http://industrial.panasonic.com/www-cgi/jvcr13pz.cgi?E+PZ+3+AOA0002+ERJ6ENF1002V+7+WW; Image: //media.digikey.com/Renders/Panasonic%20Renders/ERJ-0805%20Pkg.jpg; Digi-Key Part Number: P10.0KCCT-ND; Quantity Available: 3985614; Packaging: Cut Tape (CT); Series: ERJ; Part Status: Active; Value: 10k; Tolerance: ±1%; Composition: Thick Film; Features: Automotive AEC-Q200; Operating Temperature: -55°C ~ 155°C; Package / Case: 0805 (2012 Metric); Supplier Device Package: 0805; Size / Dimension: 0.079" L x 0.049" W (2.00mm x 1.25mm); Height - Seated (Max): 0.028" (0.70mm); Number of Terminations: 2; Failure Rate: -
SB1-SB3 = Solder Bridge: Circuit Breaker; Published: 24-Mar-1999; Revision: July-2002: Re-released for DXP Platform.; Publisher: Altium Limited

## Sheet Current Sense.SchDoc
size C
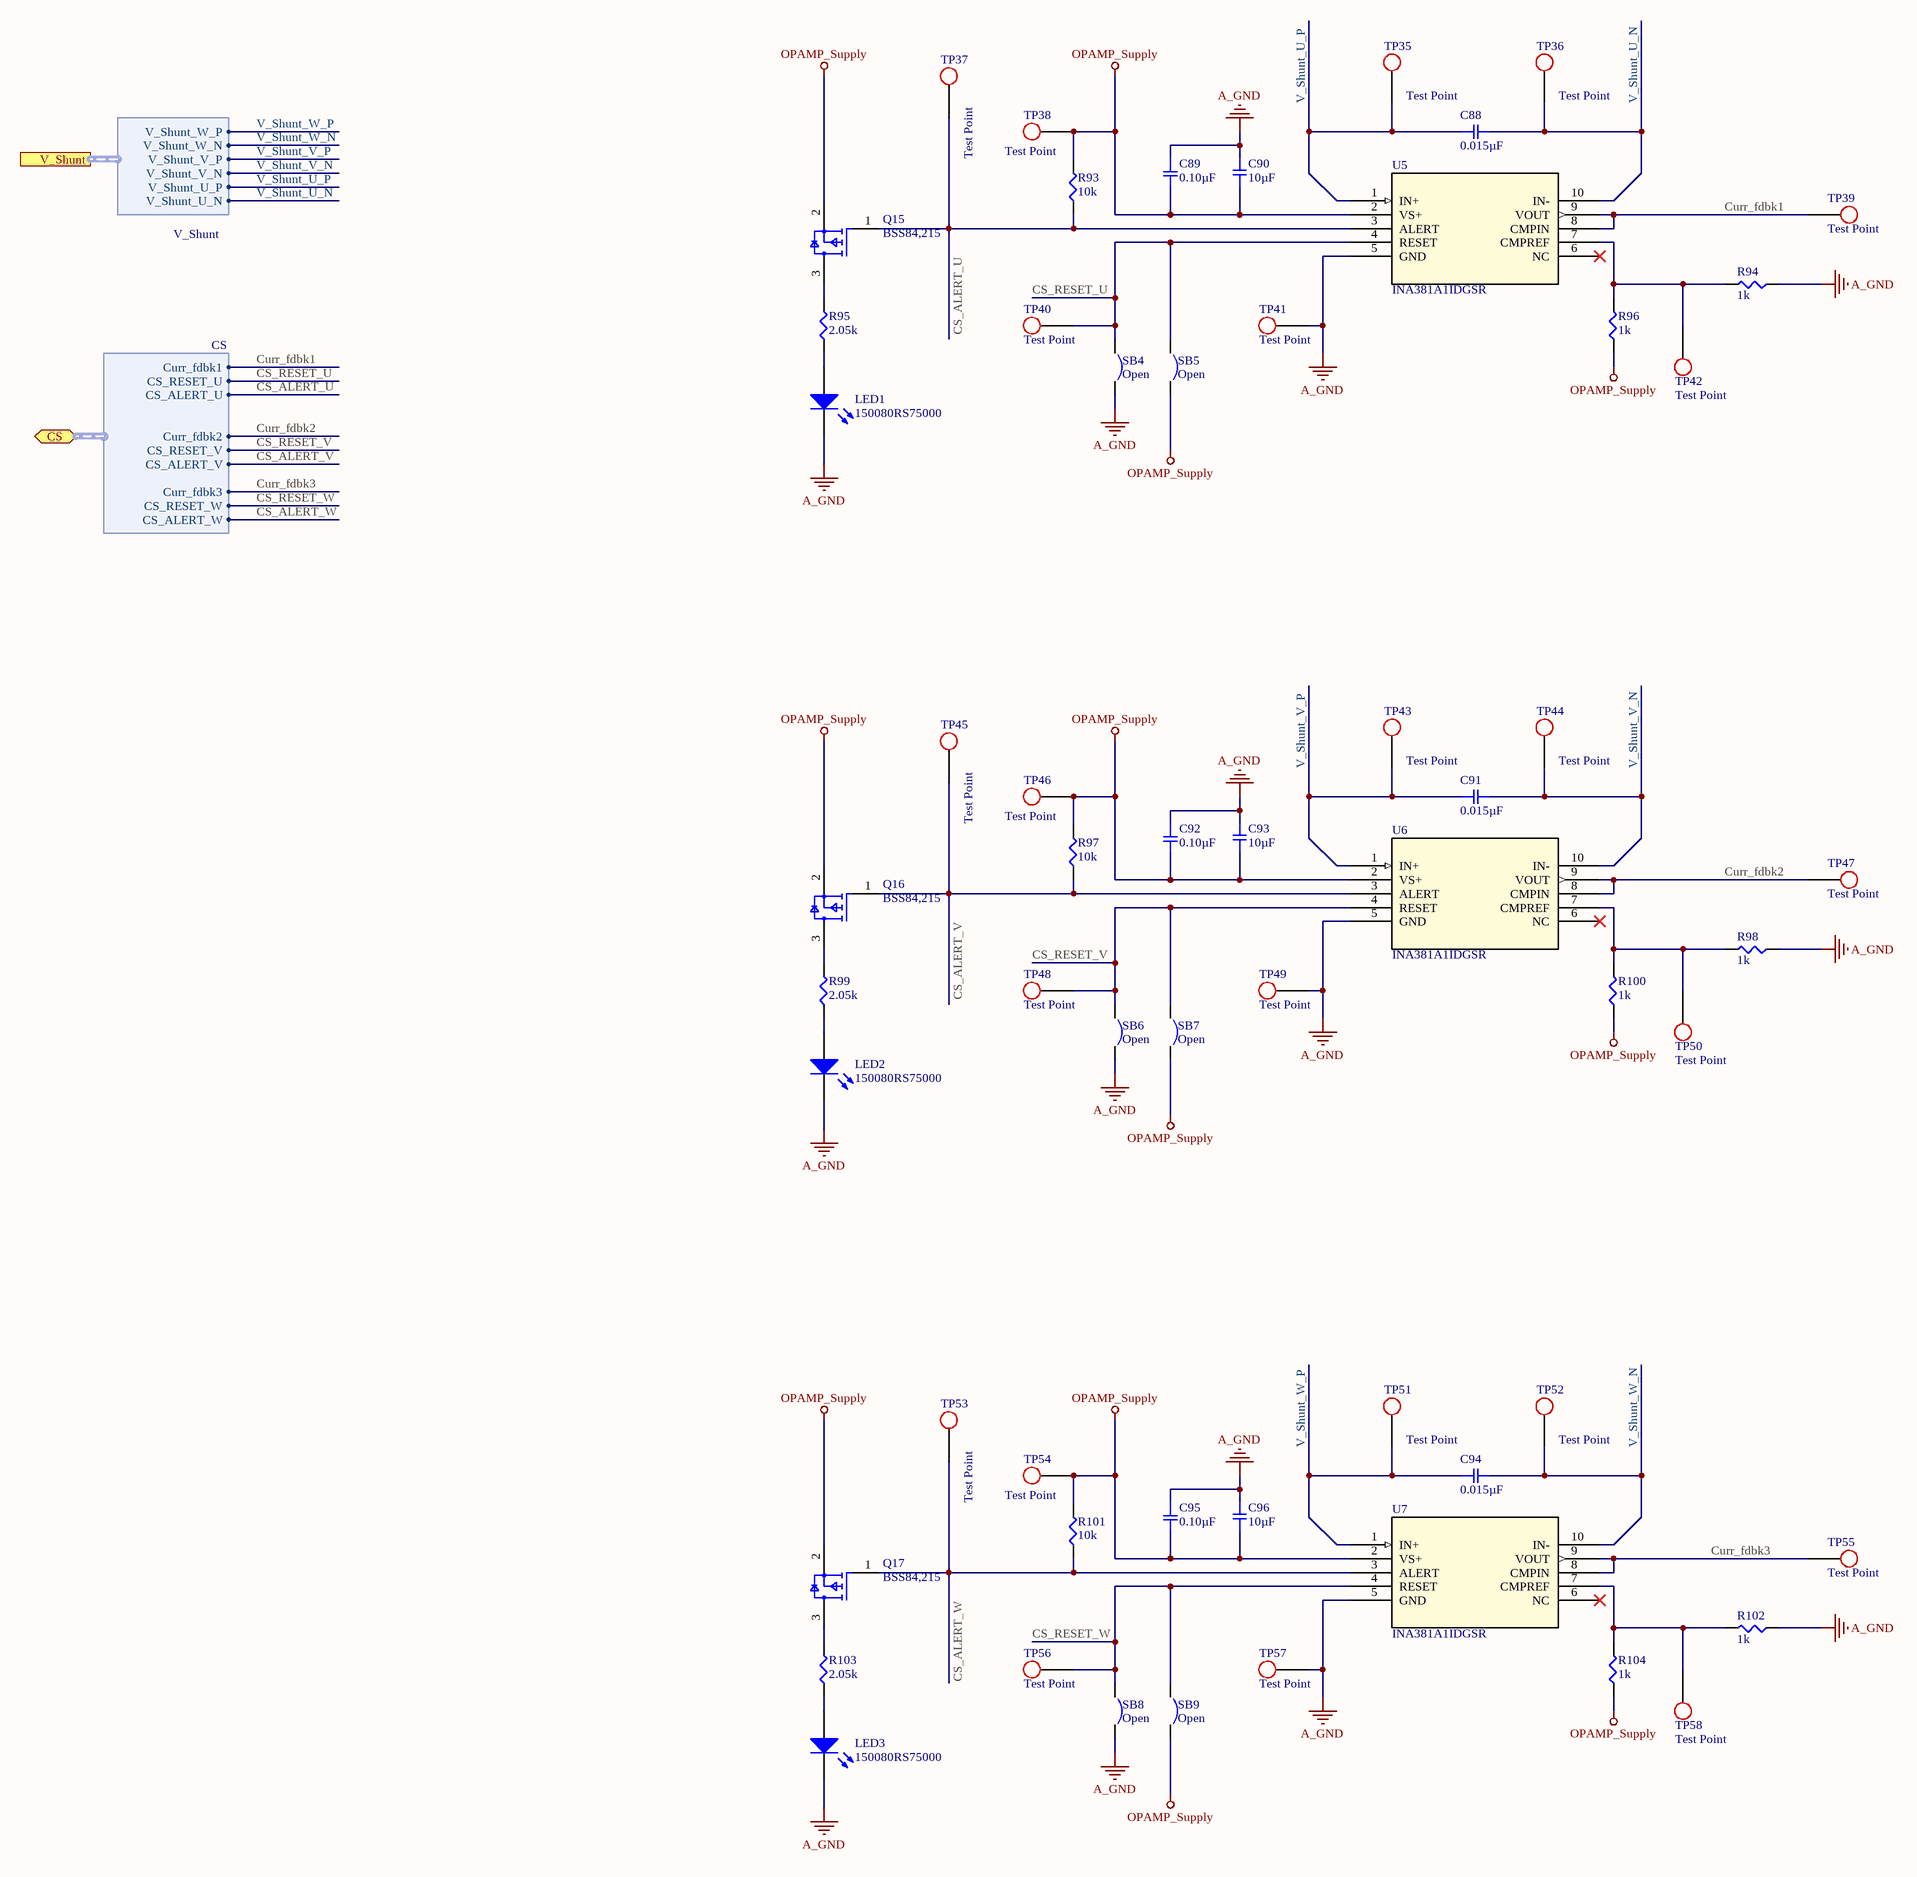
[diagram p6: Current Sense.SchDoc]

### Parts
C88  0.015µF  [SMD-0603C]
C89  0.10µF  [SMD-0805C]
C90  10µF  [SMD-1206C]
C91  0.015µF  [SMD-0603C]
C92  0.10µF  [SMD-0805C]
C93  10µF  [SMD-1206C]
C94  0.015µF  [SMD-0603C]
C95  0.10µF  [SMD-0805C]
C96  10µF  [SMD-1206C]
LED1  150080RS75000  [0805_A]
LED2  150080RS75000  [0805_A]
LED3  150080RS75000  [0805_A]
Q15  BSS84,215  [FP-SOT23-MFG]
Q16  BSS84,215  [FP-SOT23-MFG]
Q17  BSS84,215  [FP-SOT23-MFG]
R93  10k  [SMD-0603-RES]
R94  1k  [SMD-0603-RES]
R95  2.05k  [SMD-0603-RES]
R96  1k  [SMD-0603-RES]
R97  10k  [SMD-0603-RES]
R98  1k  [SMD-0603-RES]
R99  2.05k  [SMD-0603-RES]
R100  1k  [SMD-0603-RES]
R101  10k  [SMD-0603-RES]
R102  1k  [SMD-0603-RES]
R103  2.05k  [SMD-0603-RES]
R104  1k  [SMD-0603-RES]
SB4  Open  [SB_0603]  (no BOM)
SB5  Open  [SB_0603]  (no BOM)
SB6  Open  [SB_0603]  (no BOM)
SB7  Open  [SB_0603]  (no BOM)
SB8  Open  [SB_0603]  (no BOM)
SB9  Open  [SB_0603]  (no BOM)
TP35  Test Point  [Test_point_THT]  (no BOM)
TP36  Test Point  [Test_point_THT]  (no BOM)
TP37  Test Point  [Test_point_THT]  (no BOM)
TP38  Test Point  [Test_point_SMD]  (no BOM)
TP39  Test Point  [Test_point_THT]  (no BOM)
TP40  Test Point  [Test_point_SMD]  (no BOM)
TP41  Test Point  [Test_point_THT]  (no BOM)
TP42  Test Point  [Test_point_THT]  (no BOM)
TP43  Test Point  [Test_point_THT]  (no BOM)
TP44  Test Point  [Test_point_THT]  (no BOM)
TP45  Test Point  [Test_point_THT]  (no BOM)
TP46  Test Point  [Test_point_SMD]  (no BOM)
TP47  Test Point  [Test_point_THT]  (no BOM)
TP48  Test Point  [Test_point_SMD]  (no BOM)
TP49  Test Point  [Test_point_THT]  (no BOM)
TP50  Test Point  [Test_point_THT]  (no BOM)
TP51  Test Point  [Test_point_THT]  (no BOM)
TP52  Test Point  [Test_point_THT]  (no BOM)
TP53  Test Point  [Test_point_THT]  (no BOM)
TP54  Test Point  [Test_point_SMD]  (no BOM)
TP55  Test Point  [Test_point_THT]  (no BOM)
TP56  Test Point  [Test_point_SMD]  (no BOM)
TP57  Test Point  [Test_point_THT]  (no BOM)
TP58  Test Point  [Test_point_THT]  (no BOM)
U5  INA381A1IDGSR  [TSSOP50P490X110-10N]
U6  INA381A1IDGSR  [TSSOP50P490X110-10N]
U7  INA381A1IDGSR  [TSSOP50P490X110-10N]

### Ports
CS (bidir, harness CS), V_Shunt (harness V_Shunt)

### Harnesses
V_Shunt: V_Shunt_U_N, V_Shunt_U_P, V_Shunt_V_N, V_Shunt_V_P, V_Shunt_W_N, V_Shunt_W_P
CS: Curr_fdbk1, CS_RESET_U, CS_ALERT_U, Curr_fdbk2, CS_RESET_V, CS_ALERT_V, Curr_fdbk3, CS_RESET_W, CS_ALERT_W

### Nets
A_GND: C89.1 C90.2 C92.1 C93.2 C95.1 C96.2 LED1.1(K) LED2.1(K) LED3.1(K) R94.1 R98.1 R102.1 SB4.1 SB6.1 SB8.1 TP41.1 TP49.1 TP57.1 U5.5(GND) U6.5(GND) U7.5(GND)
OPAMP_Supply: C89.2 C90.1 C92.2 C93.1 C95.2 C96.1 Q15.2(S) Q16.2(S) Q17.2(S) R93.2 R96.1 R97.2 R100.1 R101.2 R104.1 SB5.1 SB7.1 SB9.1 TP38.1 TP46.1 TP54.1 U5.2(VS+) U6.2(VS+) U7.2(VS+)
CS_ALERT_U: Q15.1(G) R93.1 TP37.1 U5.3(ALERT) ; port CS.CS_ALERT_U
CS_ALERT_V: Q16.1(G) R97.1 TP45.1 U6.3(ALERT) ; port CS.CS_ALERT_V
CS_ALERT_W: Q17.1(G) R101.1 TP53.1 U7.3(ALERT) ; port CS.CS_ALERT_W
CS_RESET_U: SB4.2 SB5.2 TP40.1 U5.4(RESET) ; port CS.CS_RESET_U
CS_RESET_V: SB6.2 SB7.2 TP48.1 U6.4(RESET) ; port CS.CS_RESET_V
CS_RESET_W: SB8.2 SB9.2 TP56.1 U7.4(RESET) ; port CS.CS_RESET_W
Curr_fdbk1: TP39.1 U5.8(CMPIN) U5.9(VOUT) ; port CS.Curr_fdbk1
Curr_fdbk2: TP47.1 U6.8(CMPIN) U6.9(VOUT) ; port CS.Curr_fdbk2
Curr_fdbk3: TP55.1 U7.8(CMPIN) U7.9(VOUT) ; port CS.Curr_fdbk3
V_Shunt_U_N: C88.2 TP36.1 U5.10(IN-) ; port V_Shunt.V_Shunt_U_N
V_Shunt_U_P: C88.1 TP35.1 U5.1(IN+) ; port V_Shunt.V_Shunt_U_P
V_Shunt_V_N: C91.2 TP44.1 U6.10(IN-) ; port V_Shunt.V_Shunt_V_N
V_Shunt_V_P: C91.1 TP43.1 U6.1(IN+) ; port V_Shunt.V_Shunt_V_P
V_Shunt_W_N: C94.2 TP52.1 U7.10(IN-) ; port V_Shunt.V_Shunt_W_N
V_Shunt_W_P: C94.1 TP51.1 U7.1(IN+) ; port V_Shunt.V_Shunt_W_P
NetLED1_2: LED1.2(A) R95.1
NetLED2_2: LED2.2(A) R99.1
NetLED3_2: LED3.2(A) R103.1
NetQ15_3: Q15.3(D) R95.2
NetQ16_3: Q16.3(D) R99.2
NetQ17_3: Q17.3(D) R103.2
NetR94_2: R94.2 R96.2 TP42.1 U5.7(CMPREF)
NetR98_2: R98.2 R100.2 TP50.1 U6.7(CMPREF)
NetR102_2: R102.2 R104.2 TP58.1 U7.7(CMPREF)

Not connected (* = marked no-connect by the designer): U5 6(NC)*; U6 6(NC)*; U7 6(NC)*

### Library data of the parts
C88 C91 C94 = GCJ188R72A153KA01D: CAP CER 0.015UF 100V X7R 0603; Manufacturer: Murata Electronics North America; Factory Stock: 0; Unit Price (USD): 0.26; Minimum Quantity: 1; Tolerance: ±10%; Datasheets: http://www.murata.com/~/media/webrenewal/support/library/catalog/products/capacitor/mlcc/c03e.ashx; Image: //media.digikey.com/Renders/Murata%20Renders/0603%28LQG18%29.jpg; Digi-Key Part Number: 490-5770-1-ND; Part Number: GCJ188R72A153KA01D; Quantity Available: 450; @ qty: 0; Packaging: Cut Tape (CT); Series: GCJ; Part Status: Active; Value: 0.015µF; Voltage: 100V; Temperature Coefficient: X7R; Operating Temperature: -55°C ~ 125°C; Features: Soft Termination; Ratings: AEC-Q200; Applications: Automotive, Boardflex Sensitive; Mounting Type: Surface Mount, MLCC; Package / Case: 0603 (1608 Metric); Size / Dimension: 0.063" L x 0.031" W (1.60mm x 0.80mm); Height - Seated (Max): -; Thickness (Max): 0.031" (0.80mm); Lead Spacing: -; Lead Style: -
C89 C92 C95 = GCM21BR71H104KA37K: CAP CER 0.1UF 50V X7R 0805; Manufacturer: Murata Electronics North America; Factory Stock: 0; Unit Price (USD): 0.12; Minimum Quantity: 1; Tolerance: ±10%; Datasheets: http://www.murata.com/~/media/webrenewal/support/library/catalog/products/capacitor/mlcc/c03e.ashx; Image: //media.digikey.com/photos/Murata%20Photos/NCP,GCM%20SERIES%200805.jpg; Digi-Key Part Number: 490-8049-1-ND; Part Number: GCM21BR71H104KA37K; Quantity Available: 322; @ qty: 0; Packaging: Cut Tape (CT); Series: GCM; Part Status: Active; Value: 0.10µF; Voltage: 50V; Temperature Coefficient: X7R; Operating Temperature: -55°C ~ 125°C; Features: -; Ratings: AEC-Q200; Applications: Automotive; Mounting Type: Surface Mount, MLCC; Package / Case: 0805 (2012 Metric); Size / Dimension: 0.079" L x 0.049" W (2.00mm x 1.25mm); Height - Seated (Max): -; Thickness (Max): 0.055" (1.40mm); Lead Spacing: -; Lead Style: -
C90 C93 C96 = GRJ31CR71E106KE11L: CAP CER 10UF 25V X7R 1206; Manufacturer: Murata Electronics North America; Factory Stock: 0; Unit Price (USD): 0.69; Minimum Quantity: 1; Tolerance: ±10%; Datasheets: http://www.murata.com/~/media/webrenewal/support/library/catalog/products/capacitor/mlcc/c02e.pdf; Image: //media.digikey.com/Renders/Murata%20Renders/GR331BD72E473KW01L.jpg; Digi-Key Part Number: 490-10940-1-ND; Part Number: GRJ31CR71E106KE11L; Quantity Available: 1598; @ qty: 0; Packaging: Cut Tape (CT); Series: GRJ; Part Status: Active; Value: 10µF; Voltage: 25V; Temperature Coefficient: X7R; Operating Temperature: -55°C ~ 125°C; Features: Soft Termination; Ratings: -; Applications: Boardflex Sensitive; Mounting Type: Surface Mount, MLCC; Package / Case: 1206 (3216 Metric); Size / Dimension: 0.126" L x 0.063" W (3.20mm x 1.60mm); Height - Seated (Max): -; Thickness (Max): 0.075" (1.90mm); Lead Spacing: -; Lead Style: -
LED1-LED3 = 150080RS75000: SMD mono-color Chip LED, WL-SMCW, Red; PackageReference: 0805_A; Color: Red; PartNumber: 150080RS75000; ComponentLink1Description: Manufacturer URL; ComponentLink1URL: http://www.we-online.com; ComponentLink2Description: Datasheet; ComponentLink2URL: http://katalog.we-online.com/led/datasheet/150080RS75000.pdf
Q15-Q17 = CMP-14409-000006-1: MOSFET P-CH 50V 130MA SOT-23; Manufacturer: Nexperia USA Inc.; Drain To Source Breakdown Voltage: -50V; Description: P-Channel 50V 130mA (Ta) 250mW (Tc) Surface Mount TO-236AB; Max Junction Temp: +150°C; Threshold Vgs Min: -0.8V; Turn On Delay Time: 3ns; Power Dissipation: 250mW; Turn Off Delay Time: 7ns; Gate To Source Voltage: 20V; Number Of Channels: 1; Input Capacitace At Vds: 25pF @ -25V; Threshold Vgs Max: -2V; Continuous Drain Current: -130mA; Depletion Mode: False; Drain To Source Resistance: 6Ω; Rthja Max: 500K/W; Octopart: https://octopart.com/bss84%2C215-nexperia-78739375; Ipc Land Pattern Name: SOT95P230X100-3; Drain To Source Voltage: -50V; Lead Free: Yes; Temperature Range High: +150°C; Automotive: No; Device Class L2: Transistors; Manufacturer Part Number: BSS84,215; Package: SOT23; ComponentLink2URL: https://assets.nexperia.com/documents/data-sheet/BSS84.pdf; Category: Trans; RoHS: TRUE; Temperature Range Low: -65°C; ComponentLink2Description: Datasheet; Device Class L1: Discrete Semiconductors; Number Of P Channels: 1; Device Class L3: MOSFETs; Height: 1.1mm; Digikey Description: MOSFET P-CH 50V 130MA SOT-23; Temperature: -65°C to +150°C; Footprint Url: https://assets.nexperia.com/documents/outline-drawing/SOT23.pdf
R93 R97 R101 = ERJ-3EKF1002V: RES SMD 10K OHM 1% 1/10W 0603; Manufacturer: Panasonic Electronic Components; Factory Stock: 0; Unit Price (USD): 0.00379; @ qty: 1500; Minimum Quantity: 1; Power (Watts): 0.1W, 1/10W; Temperature Coefficient: ±100ppm/°C; Part Number: ERJ-3EKF1002V; Datasheets: http://industrial.panasonic.com/www-cgi/jvcr13pz.cgi?E+PZ+3+AOA0002+ERJ3EKF1002V+7+WW; Image: //media.digikey.com/Photos/Panasonic%20Photos/MFG_ERJ-P6W%20Series.jpg; Digi-Key Part Number: P10.0KHCT-ND; Quantity Available: 6703141; Packaging: Cut Tape (CT); Series: ERJ; Part Status: Active; Value: 10k; Tolerance: ±1%; Composition: Thick Film; Features: Automotive AEC-Q200; Operating Temperature: -55°C ~ 155°C; Package / Case: 0603 (1608 Metric); Supplier Device Package: 0603; Size / Dimension: 0.063" L x 0.031" W (1.60mm x 0.80mm); Height - Seated (Max): 0.022" (0.55mm); Number of Terminations: 2; Failure Rate: -
R94 R96 R98 R100 R102 R104 = ERJ-3EKF1001V: RES SMD 1K OHM 1% 1/10W 0603; Manufacturer: Panasonic Electronic Components; Factory Stock: 0; Unit Price (USD): 0.00379; @ qty: 1500; Minimum Quantity: 1; Power (Watts): 0.1W, 1/10W; Temperature Coefficient: ±100ppm/°C; Part Number: ERJ-3EKF1001V; Datasheets: http://industrial.panasonic.com/www-cgi/jvcr13pz.cgi?E+PZ+3+AOA0002+ERJ3EKF1001V+7+WW; Image: //media.digikey.com/Photos/Panasonic%20Photos/MFG_ERJ-P6W%20Series.jpg; Digi-Key Part Number: P1.00KHCT-ND; Quantity Available: 5218845; Packaging: Cut Tape (CT); Series: ERJ; Part Status: Active; Value: 1k; Tolerance: ±1%; Composition: Thick Film; Features: Automotive AEC-Q200; Operating Temperature: -55°C ~ 155°C; Package / Case: 0603 (1608 Metric); Supplier Device Package: 0603; Size / Dimension: 0.063" L x 0.031" W (1.60mm x 0.80mm); Height - Seated (Max): 0.022" (0.55mm); Number of Terminations: 2; Failure Rate: -
R95 R99 R103 = ERJ-3EKF2051V: RES SMD 2.05K OHM 1% 1/10W 0603; Manufacturer: Panasonic Electronic Components; Factory Stock: 0; Unit Price (USD): 0.00379; @ qty: 1500; Minimum Quantity: 1; Power (Watts): 0.1W, 1/10W; Temperature Coefficient: ±100ppm/°C; Part Number: ERJ-3EKF2051V; Datasheets: http://industrial.panasonic.com/www-cgi/jvcr13pz.cgi?E+PZ+3+AOA0002+ERJ3EKF2051V+7+WW; Image: //media.digikey.com/Photos/Panasonic%20Photos/MFG_ERJ-P6W%20Series.jpg; Digi-Key Part Number: P2.05KHCT-ND; Quantity Available: 48175; Packaging: Cut Tape (CT); Series: ERJ; Part Status: Active; Value: 2.05k; Tolerance: ±1%; Composition: Thick Film; Features: Automotive AEC-Q200; Operating Temperature: -55°C ~ 155°C; Package / Case: 0603 (1608 Metric); Supplier Device Package: 0603; Size / Dimension: 0.063" L x 0.031" W (1.60mm x 0.80mm); Height - Seated (Max): 0.022" (0.55mm); Number of Terminations: 2; Failure Rate: -
SB4-SB9 = Solder Bridge: Circuit Breaker; Published: 24-Mar-1999; Revision: July-2002: Re-released for DXP Platform.; Publisher: Altium Limited
U5-U7 = INA381A1IDGSR: No Description Available; SourceLibrary: Texas_Instruments_2020-07-20; Built_By: EMA_Matt; Vendor: Texas Instruments; Datasheet: https://www.ti.com/lit/ds/symlink/ina381.pdf?ts=1595282869145&ref_url=https%253A%252F%252Fwww.ti.com%252Fstore%252Fti%252Fen%252Fp%252Fproduct%252F%253Fp%253DINA381A1IDGSR; Copyright: Copyright (C) 2018 Accelerated Designs. All rights reserved; Manufacturer_Part_Number: INA381A1IDGSR; RefDes: RefDes; Type: DEV

## Sheet Connector.SchDoc
size A3
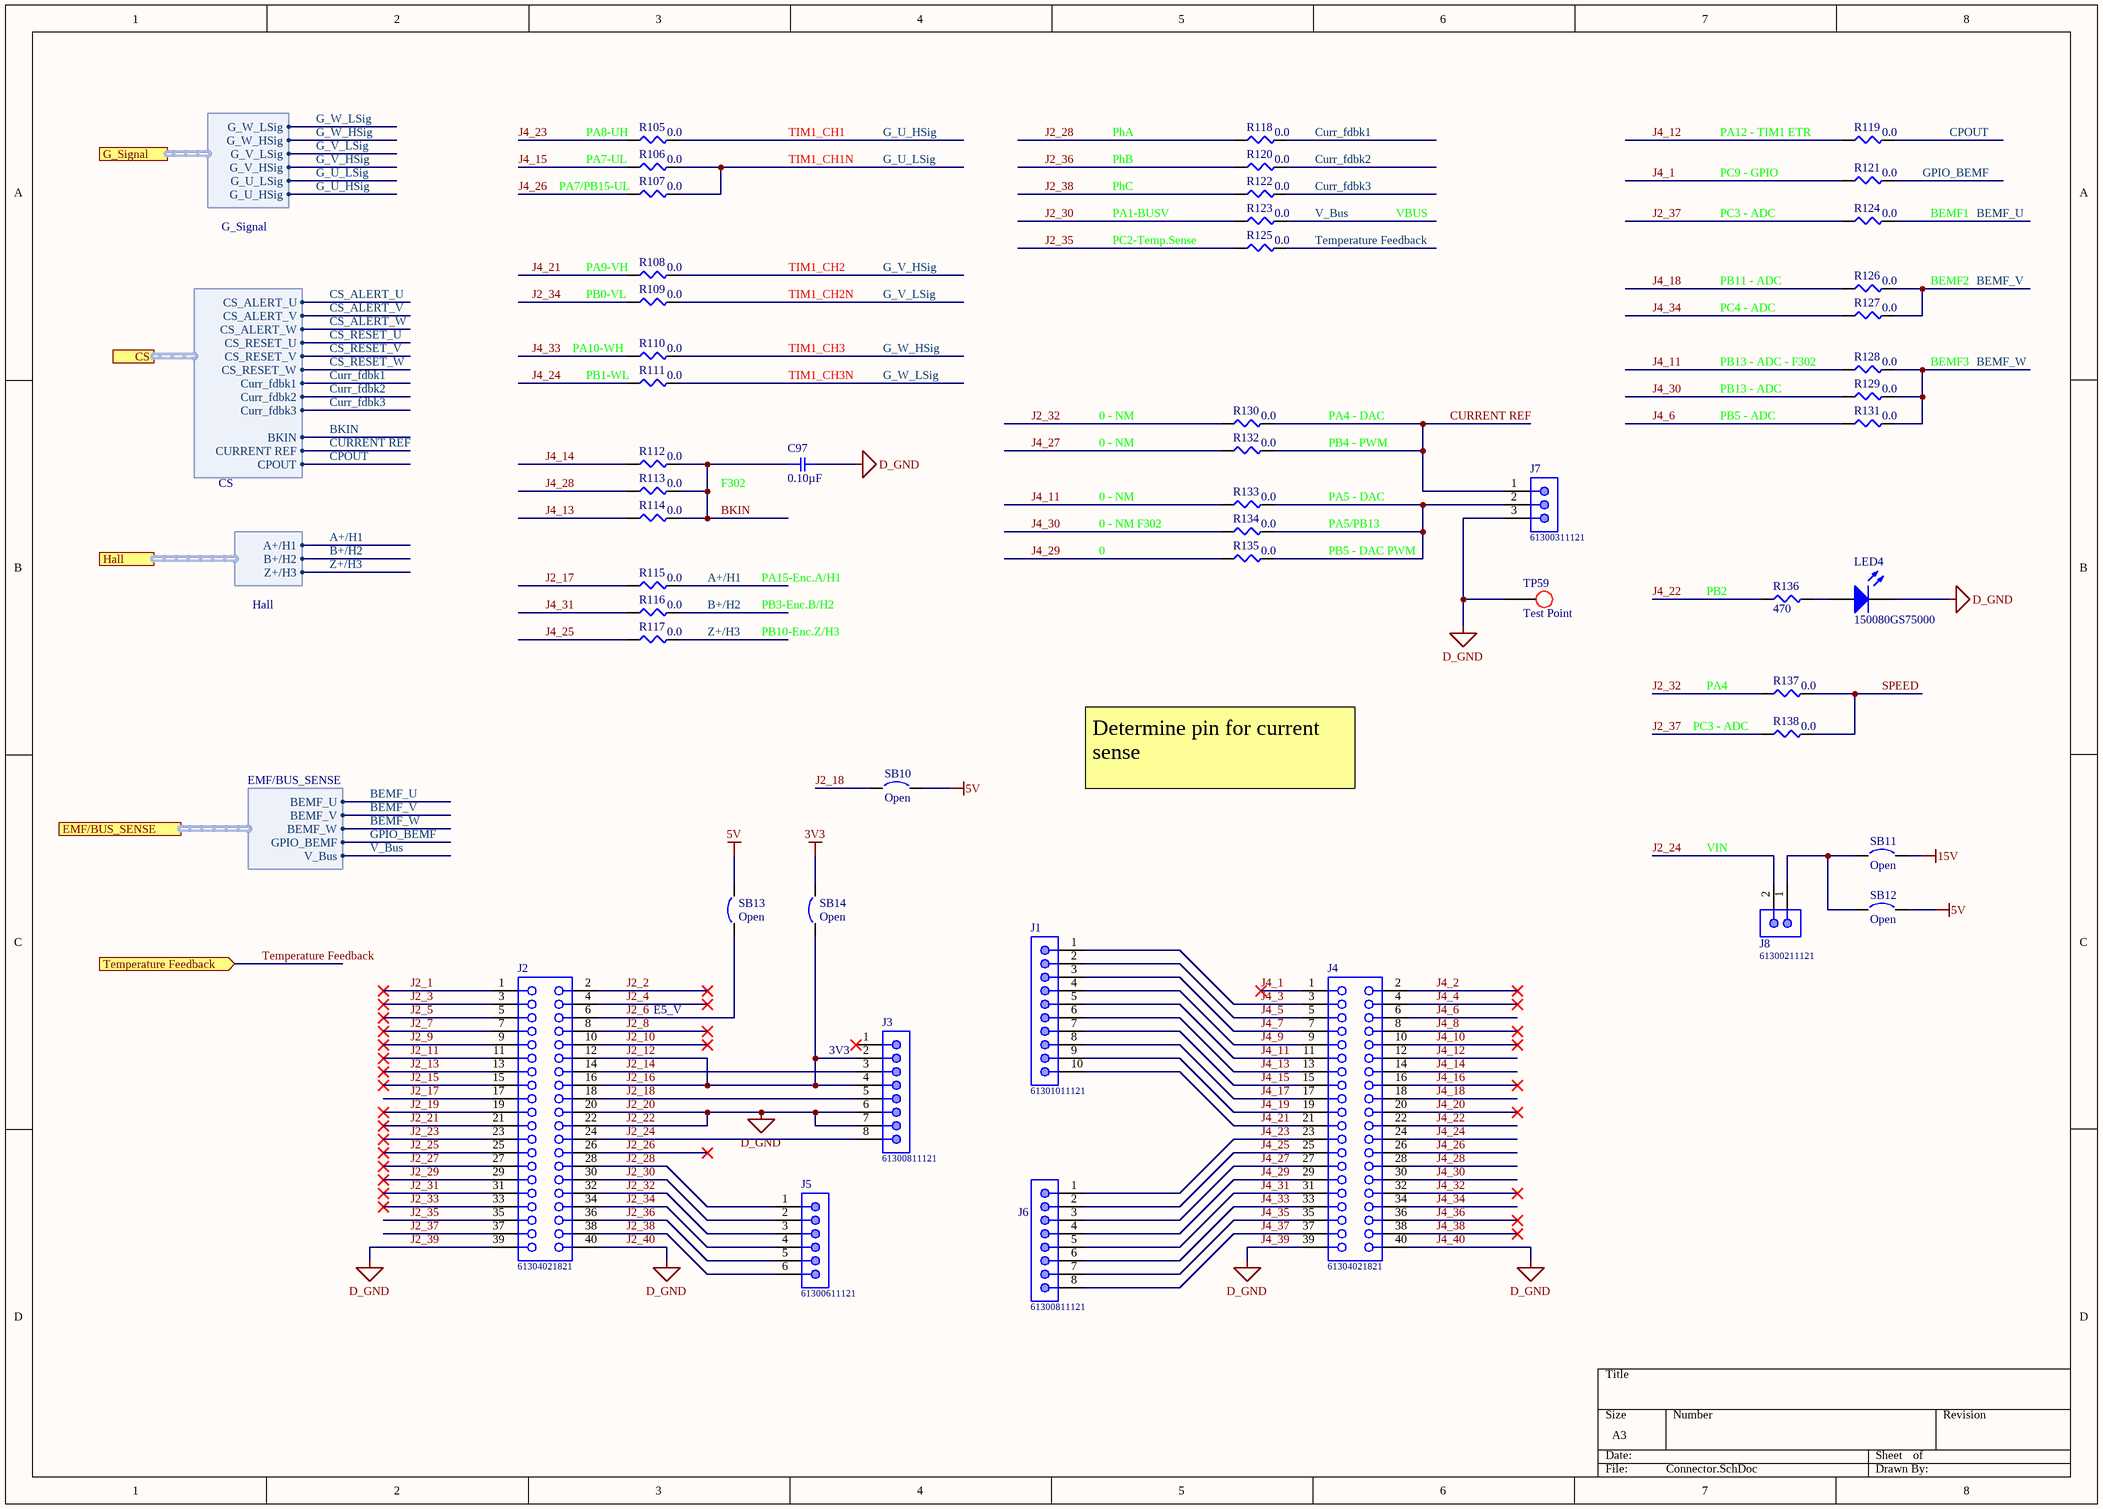
[diagram p7: Connector.SchDoc]

### Parts
C97  0.10µF  [SMD-0805C]
J1  61301011121  [61301011121]
J2  61304021821  [61304021821]
J3  61300811121  [61300811121]
J4  61304021821  [61304021821]
J5  61300611121  [61300611121]
J6  61300811121  [61300811121]
J7  61300311121  [61300311121]
J8  61300211121  [61300211121]
LED4  150080GS75000  [0805_A]
R105  0.0  [SMD-0603-RES]
R106  0.0  [SMD-0603-RES]
R107  0.0  [SMD-0603-RES]
R108  0.0  [SMD-0603-RES]
R109  0.0  [SMD-0603-RES]
R110  0.0  [SMD-0603-RES]
R111  0.0  [SMD-0603-RES]
R112  0.0  [SMD-0603-RES]
R113  0.0  [SMD-0603-RES]
R114  0.0  [SMD-0603-RES]
R115  0.0  [SMD-0603-RES]
R116  0.0  [SMD-0603-RES]
R117  0.0  [SMD-0603-RES]
R118  0.0  [SMD-0603-RES]
R119  0.0  [SMD-0603-RES]
R120  0.0  [SMD-0603-RES]
R121  0.0  [SMD-0603-RES]
R122  0.0  [SMD-0603-RES]
R123  0.0  [SMD-0603-RES]
R124  0.0  [SMD-0603-RES]
R125  0.0  [SMD-0603-RES]
R126  0.0  [SMD-0603-RES]
R127  0.0  [SMD-0603-RES]
R128  0.0  [SMD-0603-RES]
R129  0.0  [SMD-0603-RES]
R130  0.0  [SMD-0603-RES]
R131  0.0  [SMD-0603-RES]
R132  0.0  [SMD-0603-RES]
R133  0.0  [SMD-0603-RES]
R134  0.0  [SMD-0603-RES]
R135  0.0  [SMD-0603-RES]
R136  470  [SMD-0603-RES]
R137  0.0  [SMD-0603-RES]
R138  0.0  [SMD-0603-RES]
SB10  Open  [Solder Bridge - HP]  (no BOM)
SB11  Open  [Solder Bridge - HP]  (no BOM)
SB12  Open  [Solder Bridge - HP]  (no BOM)
SB13  Open  [Solder Bridge - HP]  (no BOM)
SB14  Open  [0805-Solder Bridge]  (no BOM)
TP59  Test Point  [Test_point_THT]  (no BOM)

### Ports
CS (harness CS), EMF/BUS_SENSE (harness EMF/BUS_SENSE), G_Signal (harness G_Signal), Hall (harness Hall), Temperature Feedback (in)

### Harnesses
G_Signal: G_U_HSig, G_U_LSig, G_V_HSig, G_V_LSig, G_W_HSig, G_W_LSig
CS: CS_ALERT_U, CS_ALERT_V, CS_ALERT_W, CS_RESET_U, CS_RESET_V, CS_RESET_W, Curr_fdbk1, Curr_fdbk2, Curr_fdbk3, BKIN, CURRENT REF, CPOUT
Hall: A+/H1, B+/H2, Z+/H3
EMF/BUS_SENSE: BEMF_U, BEMF_V, BEMF_W, GPIO_BEMF, V_Bus

### Nets
3V3: SB14.2
5V: SB10.2 SB12.2 SB13.2
15V: SB11.2
J2_20: C97.2 J2.20 J2.22 J2.39 J2.40 J3.6 J3.7 J4.39 J4.40 J7.3 LED4.1(K) TP59.1  [also labelled D_GND, J2_22, J2_39, J2_40, J4_39, J4_40]
A+/H1: R115.2 ; port Hall.A+/H1
B+/H2: R116.2 ; port Hall.B+/H2
BEMF_U: R124.2 ; port EMF/BUS_SENSE.BEMF_U
BEMF_V: R126.2 R127.2 ; port EMF/BUS_SENSE.BEMF_V
BEMF_W: R128.2 R129.2 R131.2 ; port EMF/BUS_SENSE.BEMF_W
BKIN: C97.1 R112.2 R113.2 R114.2 ; port CS.BKIN
CPOUT: R119.2 ; port CS.CPOUT
Curr_fdbk1: R118.2 ; port CS.Curr_fdbk1
Curr_fdbk2: R120.2 ; port CS.Curr_fdbk2
Curr_fdbk3: R122.2 ; port CS.Curr_fdbk3
CURRENT REF: J7.1 R130.2 R132.2 ; port CS.CURRENT REF
G_U_HSig: R105.2 ; port G_Signal.G_U_HSig
G_U_LSig: R106.2 R107.2 ; port G_Signal.G_U_LSig
G_V_HSig: R108.2 ; port G_Signal.G_V_HSig
G_V_LSig: R109.2 ; port G_Signal.G_V_LSig
G_W_HSig: R110.2 ; port G_Signal.G_W_HSig
G_W_LSig: R111.2 ; port G_Signal.G_W_LSig
GPIO_BEMF: R121.2 ; port EMF/BUS_SENSE.GPIO_BEMF
J2_1: J2.1
J2_2: J2.2
J2_3: J2.3
J2_4: J2.4
J2_5: J2.5
J2_6: J2.6 SB13.1
J2_7: J2.7
J2_8: J2.8
J2_9: J2.9
J2_10: J2.10
J2_11: J2.11
J2_12: J2.12 J2.16 J3.2 J3.4 SB14.1  [also labelled J2_16]
J2_13: J2.13
J2_14: J2.14 J3.3
J2_15: J2.15
J2_17: J2.17 R115.1
J2_18: J2.18 J3.5 SB10.1
J2_19: J2.19
J2_21: J2.21
J2_23: J2.23
J2_24: J2.24 J3.8 J8.2
J2_25: J2.25
J2_26: J2.26
J2_27: J2.27
J2_28: J2.28 J5.1 R118.1
J2_29: J2.29
J2_30: J2.30 J5.2 R123.1
J2_31: J2.31
J2_32: J2.32 J5.3 R130.1 R137.1
J2_33: J2.33
J2_34: J2.34 J5.4 R109.1
J2_35: J2.35 R125.1
J2_36: J2.36 J5.5 R120.1
J2_37: J2.37 R124.1 R138.1
J2_38: J2.38 J5.6 R122.1
J4_1: J4.1 R121.1
J4_2: J4.2
J4_3: J1.1 J4.3
J4_4: J4.4
J4_5: J1.2 J4.5
J4_6: J4.6 R131.1
J4_7: J1.3 J4.7
J4_8: J4.8
J4_9: J1.4 J4.9
J4_10: J4.10
J4_11: J1.5 J4.11 R128.1 R133.1
J4_12: J4.12 R119.1
J4_13: J1.6 J4.13 R114.1
J4_14: J4.14 R112.1
J4_15: J1.7 J4.15 R106.1
J4_16: J4.16
J4_17: J1.8 J4.17
J4_18: J4.18 R126.1
J4_19: J1.9 J4.19
J4_20: J4.20
J4_21: J1.10 J4.21 R108.1
J4_22: J4.22 R136.1
J4_23: J4.23 J6.1 R105.1
J4_24: J4.24 R111.1
J4_25: J4.25 J6.2 R117.1
J4_26: J4.26 R107.1
J4_27: J4.27 J6.3 R132.1
J4_28: J4.28 R113.1
J4_29: J4.29 J6.4 R135.1
J4_30: J4.30 R129.1 R134.1
J4_31: J4.31 J6.5 R116.1
J4_32: J4.32
J4_33: J4.33 J6.6 R110.1
J4_34: J4.34 R127.1
J4_35: J4.35 J6.7
J4_36: J4.36
J4_37: J4.37 J6.8
J4_38: J4.38
SPEED: R137.2 R138.2
Temperature Feedback: R125.2 ; port Temperature Feedback
V_Bus: R123.2 ; port EMF/BUS_SENSE.V_Bus
Z+/H3: R117.2 ; port Hall.Z+/H3
NetJ7_2: J7.2 R133.2 R134.2 R135.2
NetJ8_1: J8.1 SB11.1 SB12.1
NetLED4_2: LED4.2(A) R136.2

Not connected (* = marked no-connect by the designer): J3 1*

### Notes on the sheet
- (near R105) PA8-UH
- PA7-UL
- TIM1_CH1
- TIM1_CH1N
- PhA
- PhB
- PA12 - TIM1 ETR
- PC9 - GPIO
- PA7/PB15-UL
- PhC
- PA1-BUSV
- PC2-Temp.Sense
- VBUS
- PC3 - ADC
- BEMF1
- (near R108) PA9-VH
- PB0-VL
- TIM1_CH2
- TIM1_CH2N
- PB11 - ADC
- PC4 - ADC
- BEMF2
- PA10-WH
- PB1-WL
- TIM1_CH3
- TIM1_CH3N
- PB13 - ADC - F302
- BEMF3
- 0 - NM
- PA4 - DAC
- PB4 - PWM
- PB13 - ADC
- PB5 - ADC
- F302
- PA5 - DAC
- PA15-Enc.A/H1
- 0 - NM F302
- 0
- PA5/PB13
- PB5 - DAC PWM
- PB3-Enc.B/H2
- PB10-Enc.Z/H3
- (near R136) PB2
- PA4
- Determine pin for current sense
- VIN
- E5_V
- (near J3) 3V3

### Library data of the parts
C97 = GCD21BR71H104KA01L: as C13 on sheet Power_Section; Datasheets: http://www.murata.com/~/media/webrenewal/support/library/catalog/products/capacitor/mlcc/c03e.ashx; Image: //media.digikey.com/Renders/Murata%20Renders/0805%28GxM6%29.jpg; Digi-Key Part Number: 490-11955-1-ND; Part Number: GCD21BR71H104KA01L; Quantity Available: 157; @ qty: 0; Packaging: Cut Tape (CT); Series: GCD; Part Status: Active; Value: 0.10µF; Voltage: 50V; Temperature Coefficient: X7R; Operating Temperature: -55°C ~ 125°C; Features: -; Ratings: AEC-Q200; Applications: Automotive; Mounting Type: Surface Mount, MLCC; Package / Case: 0805 (2012 Metric); Size / Dimension: 0.079" L x 0.049" W (2.00mm x 1.25mm); Height - Seated (Max): -; Thickness (Max): 0.049" (1.25mm); Lead Spacing: -; Lead Style: -
J1 = 61301011121: WR-PHD Pin Header, THT, pitch 2.54mm, Single Row, Vertical, 10pin; Pin Number: 10; Gender: Male; Rated Current: 3A; Working Voltage: 250VAC; Withstanding Voltage: 500VAC; Contact Resistance: 20mOhm; ComponentLink1Description: Manufacturer; ComponentLink1URL: http://www.we-online.de; ComponentLink2Description: Datasheet; ComponentLink2URL: https://katalog.we-online.de/em/datasheet/6130xx11121.pdf; Part Number: 61301011121; Published Date: June 2019; Publisher: Wurth Elektronik; Pitch: 2.54mm; Operating Temperature: -40 to +105degC; Mounting Technology: THT; Packaging: Bag; Row Number: Single; Orientation: Vertical
J2 J4 = 61304021821: WR-PHD Socket Header, THT, pitch 2.54mm, Dual Row, Vertical, 40pin; Pin Number: 40; Gender: Female; Rated Current: 3A; Working Voltage: 250VAC; Withstanding Voltage: 500VAC; Contact Resistance: 20mOhm; ComponentLink1Description: Manufacturer; ComponentLink1URL: http://www.we-online.de; ComponentLink2Description: Datasheet; ComponentLink2URL: https://katalog.we-online.de/em/datasheet/6130xx21821.pdf; Part Number: 61304021821; Published Date: June 2019; Publisher: Wurth Elektronik; Pitch: 2.54mm; Operating Temperature: -40 to +125degC; Mounting Technology: THT; Packaging: Tray; Row Number: Dual; Orientation: Vertical
J3 J6 = 61300811121: WR-PHD Pin Header, THT, pitch 2.54mm, Single Row, Vertical, 8pin; Pin Number: 8; Gender: Male; Rated Current: 3A; Working Voltage: 250VAC; Withstanding Voltage: 500VAC; Contact Resistance: 20mOhm; ComponentLink1Description: Manufacturer; ComponentLink1URL: http://www.we-online.de; ComponentLink2Description: Datasheet; ComponentLink2URL: https://katalog.we-online.de/em/datasheet/6130xx11121.pdf; Part Number: 61300811121; Published Date: June 2019; Publisher: Wurth Elektronik; Pitch: 2.54mm; Operating Temperature: -40 to +105degC; Mounting Technology: THT; Packaging: Bag; Row Number: Single; Orientation: Vertical
J5 = 61300611121: WR-PHD Pin Header, THT, pitch 2.54mm, Single Row, Vertical, 6pin; Pin Number: 6; Gender: Male; Rated Current: 3A; Working Voltage: 250VAC; Withstanding Voltage: 500VAC; Contact Resistance: 20mOhm; ComponentLink1Description: Manufacturer; ComponentLink1URL: http://www.we-online.de; ComponentLink2Description: Datasheet; ComponentLink2URL: https://katalog.we-online.de/em/datasheet/6130xx11121.pdf; Part Number: 61300611121; Published Date: June 2019; Publisher: Wurth Elektronik; Pitch: 2.54mm; Operating Temperature: -40 to +105degC; Mounting Technology: THT; Packaging: Bag; Row Number: Single; Orientation: Vertical
J7 = 61300311121: WR-PHD Pin Header, THT, pitch 2.54mm, Single Row, Vertical, 3pin; Pin Number: 3; Gender: Male; Rated Current: 3A; Working Voltage: 250VAC; Withstanding Voltage: 500VAC; Contact Resistance: 20mOhm; ComponentLink1Description: Manufacturer; ComponentLink1URL: http://www.we-online.de; ComponentLink2Description: Datasheet; ComponentLink2URL: https://katalog.we-online.de/em/datasheet/6130xx11121.pdf; Part Number: 61300311121; Published Date: June 2019; Publisher: Wurth Elektronik; Pitch: 2.54mm; Operating Temperature: -40 to +105degC; Mounting Technology: THT; Packaging: Bag; Row Number: Single; Orientation: Vertical
J8 = 61300211121: WR-PHD Pin Header, THT, pitch 2.54mm, Single Row, Vertical, 2pin; Pin Number: 2; Gender: Male; Rated Current: 3A; Working Voltage: 250VAC; Withstanding Voltage: 500VAC; Contact Resistance: 20mOhm; ComponentLink1Description: Manufacturer; ComponentLink1URL: http://www.we-online.de; ComponentLink2Description: Datasheet; ComponentLink2URL: https://katalog.we-online.de/em/datasheet/6130xx11121.pdf; Part Number: 61300211121; Published Date: June 2019; Publisher: Wurth Elektronik; Pitch: 2.54mm; Operating Temperature: -40 to +105degC; Mounting Technology: THT; Packaging: Bag; Row Number: Single; Orientation: Vertical
LED4 = 150080GS75000: SMD mono-color Chip LED, WL-SMCW, Green; PackageReference: 0805_A; Color: Green; PartNumber: 150080GS75000; ComponentLink1Description: Manufacturer URL; ComponentLink1URL: http://www.we-online.com; ComponentLink2Description: Datasheet; ComponentLink2URL: http://katalog.we-online.com/led/datasheet/150080GS75000.pdf
R105-R135 R137 R138 = ERJ-3GEY0R00V: RES SMD 0.0OHM JUMPER 1/10W 0603; Manufacturer: Panasonic Electronic Components; Factory Stock: 0; Unit Price (USD): 0.00352; @ qty: 1500; Minimum Quantity: 1; Power (Watts): 0.1W, 1/10W; Part Number: ERJ-3GEY0R00V; Datasheets: http://industrial.panasonic.com/www-cgi/jvcr13pz.cgi?E+PZ+3+AOA0001+ERJ3GEY0R00V+7+WW; Image: //media.digikey.com/Photos/Panasonic%20Photos/MFG_ERJ-P6W%20Series.jpg; Digi-Key Part Number: P0.0GCT-ND; Quantity Available: 4813372; Packaging: Cut Tape (CT); Series: ERJ; Part Status: Active; Value: 0.0; Tolerance: Jumper; Composition: Thick Film; Features: Automotive AEC-Q200; Temperature Coefficient: -; Operating Temperature: -55°C ~ 155°C; Package / Case: 0603 (1608 Metric); Supplier Device Package: 0603; Size / Dimension: 0.063" L x 0.031" W (1.60mm x 0.80mm); Height - Seated (Max): 0.022" (0.55mm); Number of Terminations: 2; Failure Rate: -
R136 = ERJ-3EKF4700V: RES SMD 470 OHM 1% 1/10W 0603; Manufacturer: Panasonic Electronic Components; Factory Stock: 0; Unit Price (USD): 0.00379; @ qty: 1500; Minimum Quantity: 1; Power (Watts): 0.1W, 1/10W; Temperature Coefficient: ±100ppm/°C; Part Number: ERJ-3EKF4700V; Datasheets: http://industrial.panasonic.com/www-cgi/jvcr13pz.cgi?E+PZ+3+AOA0002+ERJ3EKF4700V+7+WW; Image: //media.digikey.com/Photos/Panasonic%20Photos/MFG_ERJ-P6W%20Series.jpg; Digi-Key Part Number: P470HCT-ND; Quantity Available: 553629; Packaging: Cut Tape (CT); Series: ERJ; Part Status: Active; Value: 470; Tolerance: ±1%; Composition: Thick Film; Features: Automotive AEC-Q200; Operating Temperature: -55°C ~ 155°C; Package / Case: 0603 (1608 Metric); Supplier Device Package: 0603; Size / Dimension: 0.063" L x 0.031" W (1.60mm x 0.80mm); Height - Seated (Max): 0.022" (0.55mm); Number of Terminations: 2; Failure Rate: -
SB10-SB14 = Solder Bridge: Circuit Breaker; Published: 24-Mar-1999; Revision: July-2002: Re-released for DXP Platform.; Publisher: Altium Limited